# EAGLE schematic cfc-card (EAGLE 9.6.2)

## Sheet 1 of 5: Connectors
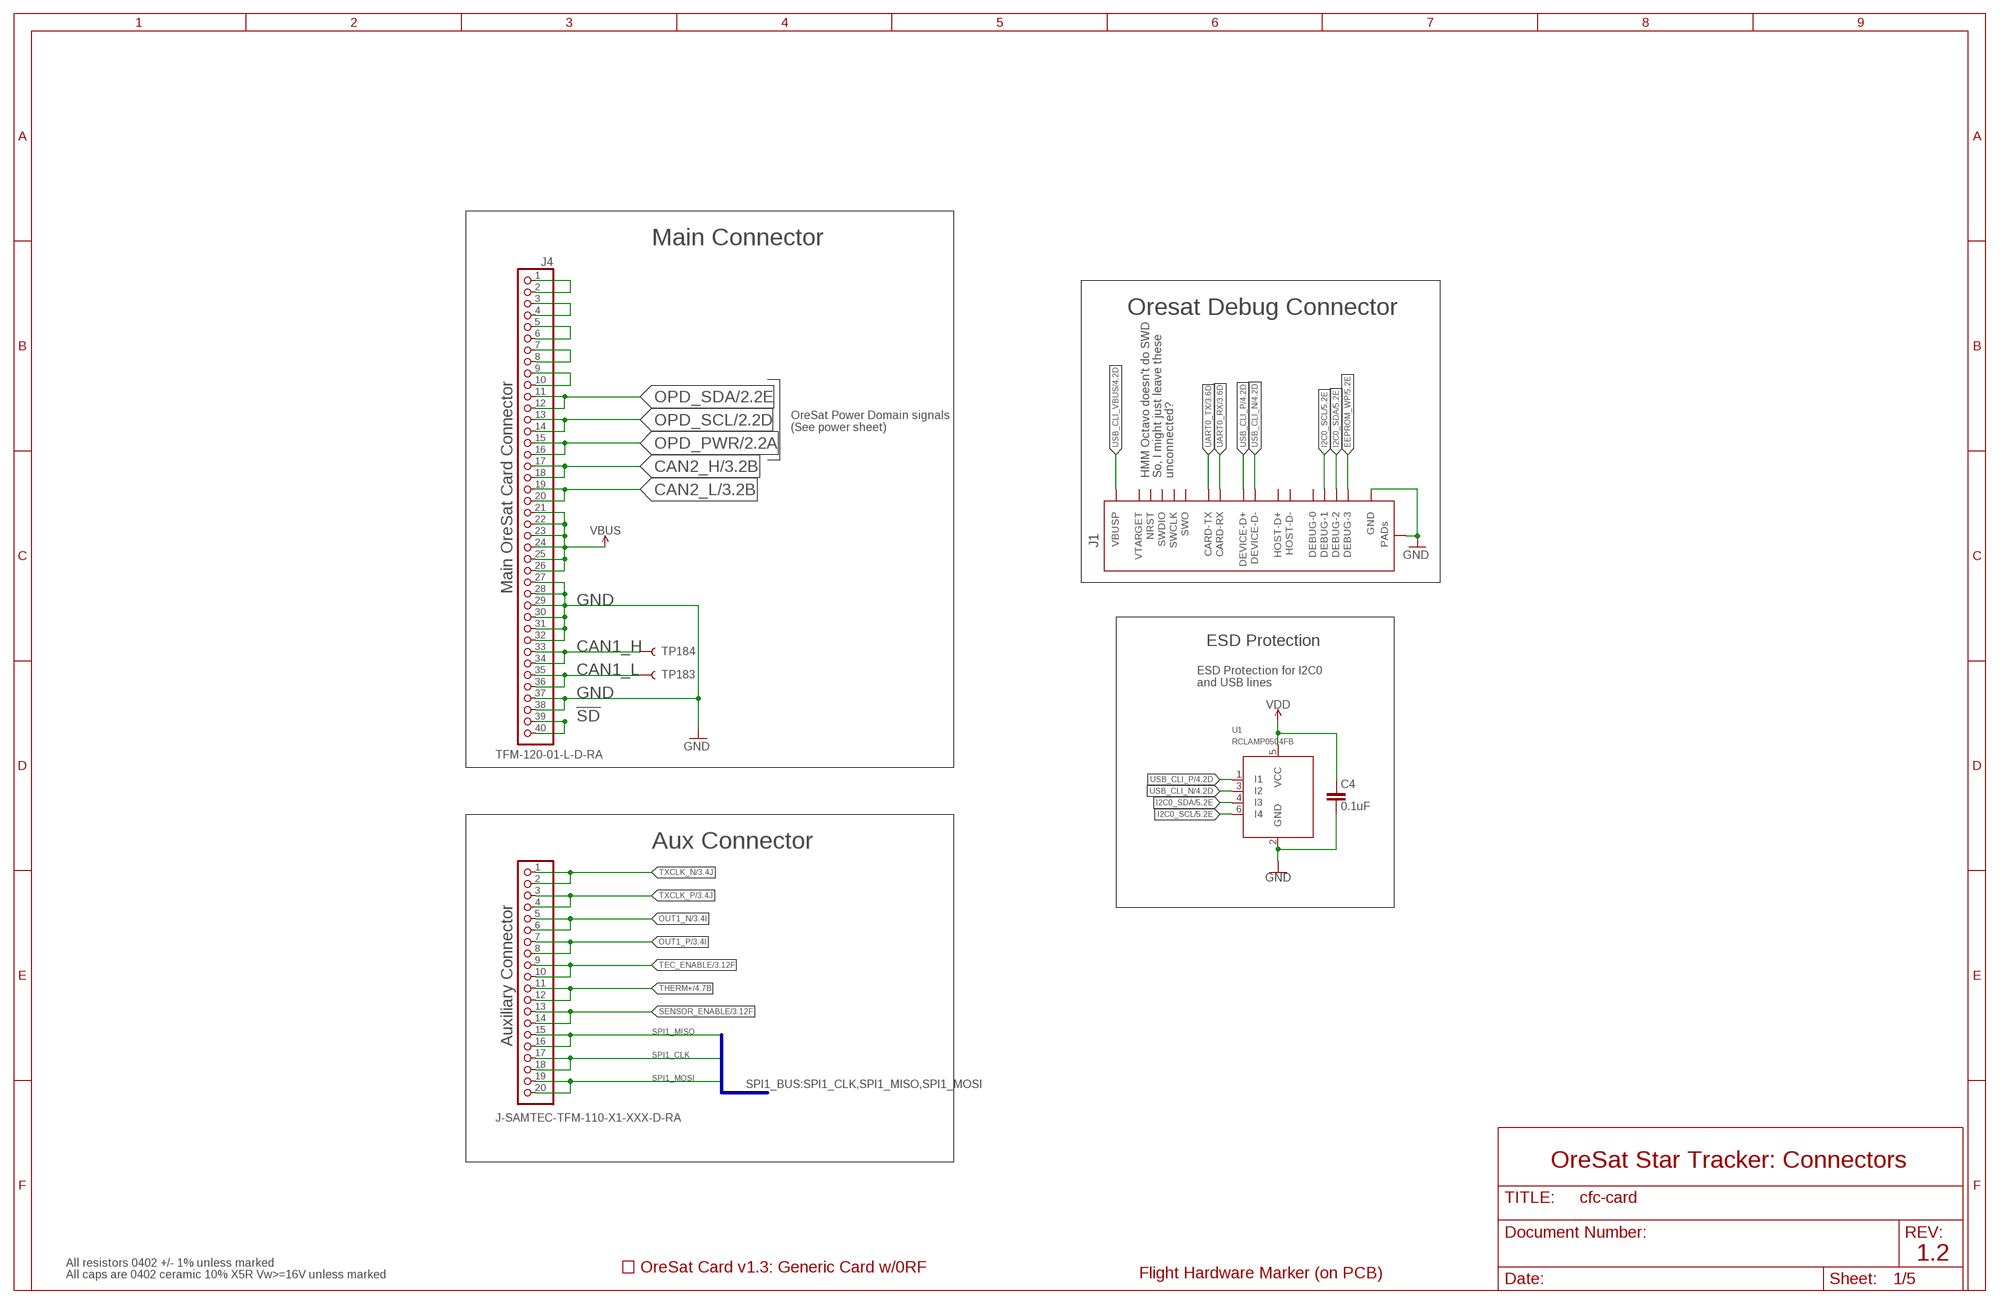
[diagram p0: schematic, sheet 1]

### Parts
C4  0.1uF  C-EU0603-A  [.0603-A]
J1  ORESAT-DEBUG-CONNECTOR-ALL  [TE_2-1734592-0]
J2  J-SAMTEC-TFM-110-X1-XXX-D-RA  [J-SAMTEC-TFM-110-X1-XXX-D-RA]
J4  TFM-120-01-L-D-RA  J-SAMTEC-TFM-120-X1-XXX-D-RA  [J-SAMTEC-TFM-120-X1-XXX-D-RA]
PCB1  ORESAT-CARD-V1.3-GENERIC-0RF  [ORESAT-CARD-V1.3-GENERIC-0RF]
TP183  TEST-POINT3X4  [PAD.03X.04]
TP184  TEST-POINT3X4  [PAD.03X.04]
U1  RCLAMP0504FB  [SC70-6]
U$1  FLIGHMARKERNEW  [FLIGHTMARKER_NEW_BOARDS]

### Nets
!SD: J4.39 J4.40
CAN1_H: J4.33 J4.34 TP184.P$1
CAN1_L: J4.35 J4.36 TP183.P$1
CAN2_H: J4.17 J4.18 ; also sheet 3
CAN2_L: J4.19 J4.20 ; also sheet 3
EEPROM_WP: J1.20(DEBUG-3) ; also sheet 5
GND: C4.2 J1.3(GND) J1.6(GND) J1.9(GND) J1.PAD1(PAD) J1.PAD2(PAD) J4.27 J4.28 J4.29 J4.30 J4.31 J4.32 J4.37 J4.38 U1.2(GND) ; also sheet 2,3,4,5
I2C0_SCL: J1.18(DEBUG-1) U1.6(I4) ; also sheet 5
I2C0_SDA: J1.19(DEBUG-2) U1.4(I3) ; also sheet 5
N$103: J4.1 J4.2
OPD_PWR: J4.15 J4.16 ; also sheet 2
OPD_SCL: J4.13 J4.14 ; also sheet 2
OPD_SDA: J4.11 J4.12 ; also sheet 2
OUT1_N [diff pair]: J2.5 J2.6 ; also sheet 3
OUT1_P [diff pair]: J2.7 J2.8 ; also sheet 3
SENSOR_ENABLE: J2.13 J2.14 ; also sheet 3
SPARE1: J4.9 J4.10
SPARE2: J4.7 J4.8
SPARE3: J4.5 J4.6
SPARE4: J4.3 J4.4
SPI1_CLK: J2.17 J2.18 ; also sheet 3
SPI1_MISO: J2.15 J2.16 ; also sheet 3
SPI1_MOSI: J2.19 J2.20 ; also sheet 3
TEC_ENABLE: J2.9 J2.10 ; also sheet 3
THERM+: J2.11 J2.12 ; also sheet 4
TXCLK_N [diff pair]: J2.1 J2.2 ; also sheet 3
TXCLK_P [diff pair]: J2.3 J2.4 ; also sheet 3
UART0_RX: J1.12(CARD-RX) ; also sheet 3
UART0_TX: J1.13(CARD-TX) ; also sheet 3
USB_CLI_N: J1.5(DEVICE-D-) U1.3(I2) ; also sheet 4
USB_CLI_P: J1.4(DEVICE-D+) U1.1(I1) ; also sheet 4
USB_CLI_VBUS: J1.1(VBUSP) J1.2(VBUSP) ; also sheet 4
VBUS: J4.21 J4.22 J4.23 J4.24 J4.25 J4.26 ; also sheet 2
VDD: C4.1 U1.5(VCC) ; also sheet 5
Unconnected: J1.7(HOST-D+) J1.8(HOST-D-) J1.10(NRST) J1.11(VTARGET) J1.14(SWDIO) J1.15(SWCLK) J1.16(SWO) J1.17(DEBUG-0)

### Buses
SPI1_BUS:SPI1_CLK,SPI1_MISO,SPI1_MOSI

### Notes on the sheet
- Main Connector
- Oresat Debug Connector
- OreSat Power Domain signals
  (See power sheet)
- HMM Octavo doesn't do SWD
  So, I might just leave these 
  unconnected?
- Main OreSat Card Connector
- ESD Protection
- ESD Protection for I2C0 
  and USB lines
- Aux Connector
- Auxiliary Connector
- OreSat Star Tracker: Connectors
- 1.2
- All resistors 0402 +/- 1% unless marked
- All caps are 0402 ceramic 10% X5R Vw>=16V unless marked

## Sheet 2 of 5: Power
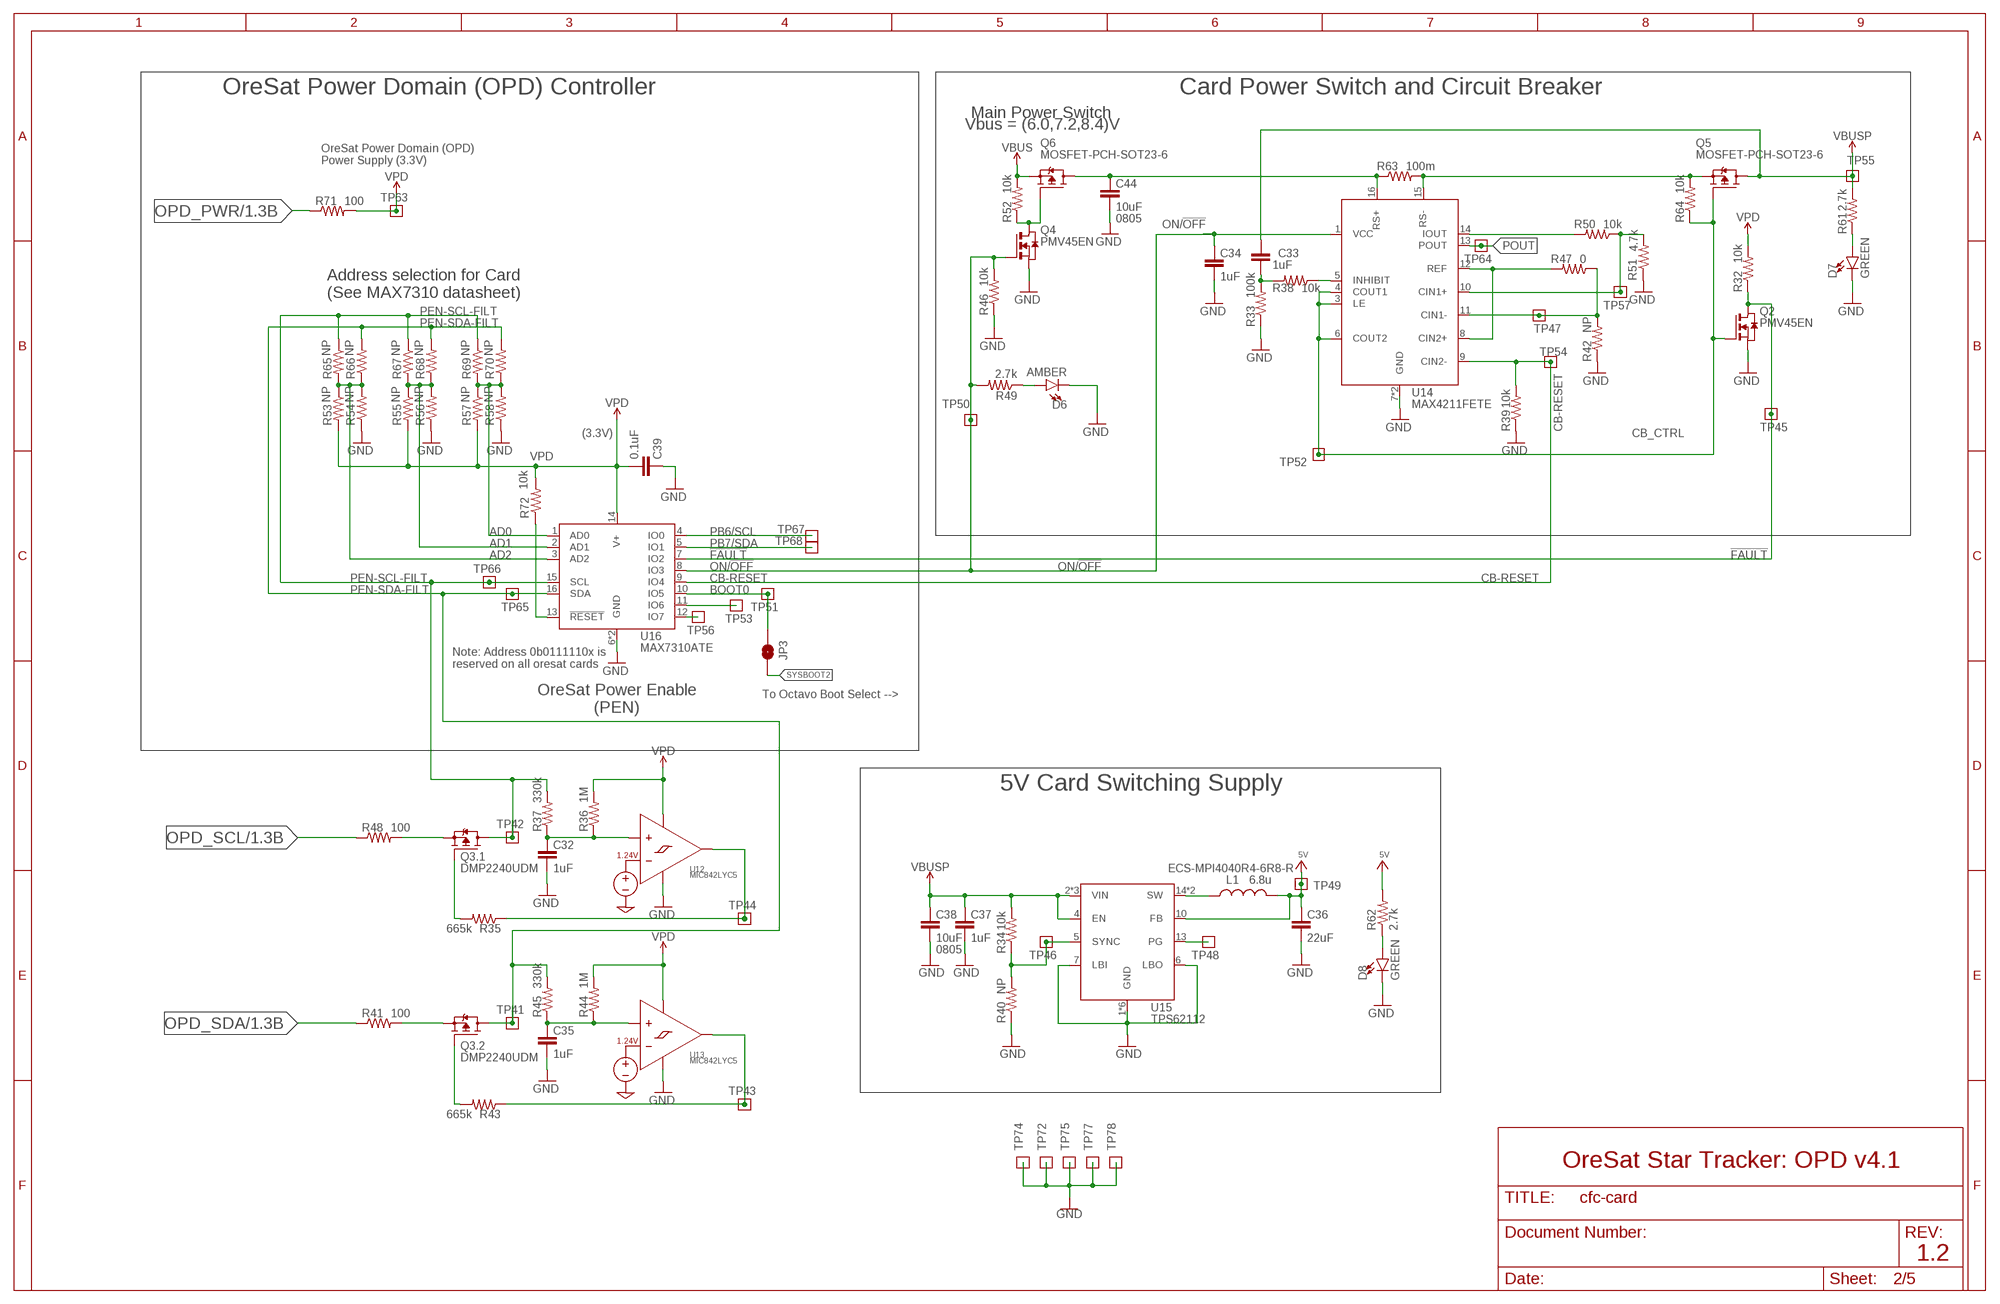
[diagram p1: schematic, sheet 2]

### Parts
C32  1uF  C-EU0805-B-NOSILK  [.0805-B-NOSILK]
C33  1uF  C-EU0603-A  [.0603-A]
C34  1uF  C-EU0603-A  [.0603-A]
C35  1uF  C-EU0805-B-NOSILK  [.0805-B-NOSILK]
C36  22uF  C-EUC1210  [C1210]
C37  1uF  C-EU0603-A  [.0603-A]
C38  10uF  C-EU0805-B  [.0805-B]
C39  0.1uF  C-EU0603-A  [.0603-A]
C44  10uF  C-EU0805-B  [.0805-B]
D6  AMBER  LED-GREEN0603  [LED-0603]
D7  GREEN  LED-GREEN0603  [LED-0603]
D8  GREEN  LED-GREEN0603  [LED-0603]
JP3  JUMPER-SMT_2_NO_SILK  [SMT-JUMPER_2_NO_SILK]
L1  6.8u  L-ECS-MPI4040  [ECS-MPI4040]
Q2  PMV45EN  [SOT23]
Q3  DMP2240UDM  MOSFET-PCH-SOT23-6  [SOT23-6]
Q4  PMV45EN  [SOT23]
Q5  MOSFET-PCH-SOT23-6  [SOT23-6]
Q6  MOSFET-PCH-SOT23-6  [SOT23-6]
R32  10k  R-US_0603-A  [.0603-A]
R33  100k  R-US_0603-A  [.0603-A]
R34  10k  R-US_0603-A  [.0603-A]
R35  665k  R-US_0603-A  [.0603-A]
R36  1M  R-US_0603-A  [.0603-A]
R37  330k  R-US_0603-A  [.0603-A]
R38  10k  R-US_0603-A  [.0603-A]
R39  10k  R-US_0603-A  [.0603-A]
R40  NP  R-US_0603-A  [.0603-A]
R41  100  R-US_0603-A  [.0603-A]
R42  NP  R-US_0603-A  [.0603-A]
R43  665k  R-US_0603-A  [.0603-A]
R44  1M  R-US_0603-A  [.0603-A]
R45  330k  R-US_0603-A  [.0603-A]
R46  10k  R-US_0603-A  [.0603-A]
R47  0  R-US_0603-A  [.0603-A]
R48  100  R-US_0603-A  [.0603-A]
R49  2.7k  R-US_0603-A  [.0603-A]
R50  10k  R-US_0603-A  [.0603-A]
R51  4.7k  R-US_0603-A  [.0603-A]
R52  10k  R-US_0603-A  [.0603-A]
R53  NP  R-US_0603-A  [.0603-A]
R54  NP  R-US_0603-A  [.0603-A]
R55  NP  R-US_0603-A  [.0603-A]
R56  NP  R-US_0603-A  [.0603-A]
R57  NP  R-US_0603-A  [.0603-A]
R58  NP  R-US_0603-A  [.0603-A]
R61  2.7k  R-US_0603-A  [.0603-A]
R62  2.7k  R-US_0603-A  [.0603-A]
R63  100m  R-US_R1206  [R1206]
R64  10k  R-US_0603-A  [.0603-A]
R65  NP  R-US_0603-A  [.0603-A]
R66  NP  R-US_0603-A  [.0603-A]
R67  NP  R-US_0603-A  [.0603-A]
R68  NP  R-US_0603-A  [.0603-A]
R69  NP  R-US_0603-A  [.0603-A]
R70  NP  R-US_0603-A  [.0603-A]
R71  100  R-US_0603-A  [.0603-A]
R72  10k  R-US_0603-A  [.0603-A]
TP41  TEST-POINT  [2MM-TEST-POINT]
TP42  TEST-POINT  [2MM-TEST-POINT]
TP43  TEST-POINT  [2MM-TEST-POINT]
TP44  TEST-POINT  [2MM-TEST-POINT]
TP45  TEST-POINT  [2MM-TEST-POINT]
TP46  TEST-POINT  [2MM-TEST-POINT]
TP47  TEST-POINT  [2MM-TEST-POINT]
TP48  TEST-POINT  [2MM-TEST-POINT]
TP49  TEST-POINT  [2MM-TEST-POINT]
TP50  TEST-POINT  [2MM-TEST-POINT]
TP51  TEST-POINT  [2MM-TEST-POINT]
TP52  TEST-POINT  [2MM-TEST-POINT]
TP53  TEST-POINT  [2MM-TEST-POINT]
TP54  TEST-POINT  [2MM-TEST-POINT]
TP55  TEST-POINT  [2MM-TEST-POINT]
TP56  TEST-POINT  [2MM-TEST-POINT]
TP57  TEST-POINT  [2MM-TEST-POINT]
TP63  TEST-POINT  [2MM-TEST-POINT]
TP64  TEST-POINT  [2MM-TEST-POINT]
TP65  TEST-POINT  [2MM-TEST-POINT]
TP66  TEST-POINT  [2MM-TEST-POINT]
TP67  TEST-POINT  [2MM-TEST-POINT]
TP68  TEST-POINT  [2MM-TEST-POINT]
TP72  TEST-POINT  [2MM-TEST-POINT]
TP74  TEST-POINT  [2MM-TEST-POINT]
TP75  TEST-POINT  [2MM-TEST-POINT]
TP77  TEST-POINT  [2MM-TEST-POINT]
TP78  TEST-POINT  [2MM-TEST-POINT]
U12  MIC842LYC5  [SC70-5]
U13  MIC842LYC5  [SC70-5]
U14  MAX4211FETE  MAX4211  [QFN65P400X400X80-17T210]
U15  TPS62112  TPS6211X  [S-PVQFN-16]
U16  MAX7310ATE  MAX7310  [QFN65P400X400X80-17T210]

### Nets
5V: C36.1 L1.2 R62.2 TP49.1 U15.10(FB) ; also sheet 5
!FAULT: Q2.3(D) R32.1 TP45.1 U16.7(IO2)
AD0: R57.1 R58.2 R69.2 R70.1 U16.1(AD0)
AD1: R55.1 R56.2 R67.2 R68.1 U16.2(AD1)
AD2: R53.1 R54.2 R65.2 R66.1 U16.3(AD2)
BOOT0: JP3.1 TP51.1 U16.10(IO5)
CB-RESET: R39.2 TP54.1 U14.9(CIN2-) U16.9(IO4)
CB_CTRL: Q2.1(G) Q5.3(G) R64.1 TP52.1 U14.3(LE) U14.4(COUT1) U14.6(COUT2)
GND: C32.2 C34.2 C35.2 C36.2 C37.2 C38.2 C39.1 C44.2 D6.C D7.C D8.C Q2.2(S) Q4.2(S) R33.1 R39.1 R40.1 R42.1 R46.1 R51.1 R54.1 R56.1 R58.1 TP72.1 TP74.1 TP75.1 TP77.1 TP78.1 U12.2(GND) U13.2(GND) U14.7(GND) U14.EPAD(GND) U15.1(GND) U15.6(LBO) U15.7(LBI) U15.9(GND) U15.11(GND) U15.12(GND) U15.16(GND) U15.PAD(GND) U16.6(GND) U16.EPAD(GND) ; also sheet 1,3,4,5
IOUT: R50.2 U14.14(IOUT)
N$25: C32.1 R36.1 R37.1 U12.1(INP)
N$27: R35.1 TP44.1 U12.4(OUT)
N$32: TP56.1 U16.12(IO7)
N$98: C44.1 Q6.1(D) Q6.2(D) Q6.5(D) Q6.6(D) R63.1 U14.16(RS+)
N$99: Q5.4(S) R63.2 R64.2 U14.15(RS-)
N$100: C35.1 R44.1 R45.1 U13.1(INP)
N$113: Q3.3(.2:G) R43.2
N$117: Q3.1(.1:G) R35.2
N$270: D7.A R61.1
N$271: D8.A R62.1
N$385: TP53.1 U16.11(IO6)
N$479: Q3.5(.1:S) R48.2
N$575: D6.A R49.1
N$579: Q3.2(.2:S) R41.2
N$580: R43.1 TP43.1 U13.4(OUT)
N$589: R72.1 U16.13(!RESET)
N$590: Q4.3(D) Q6.3(G) R52.1
N$596: R50.1 R51.2 TP57.1 U14.10(CIN1+)
N$597: R42.2 R47.1 TP47.1 U14.11(CIN1-)
N$599: R47.2 U14.8(CIN2+) U14.12(REF)
N$603: C33.1 R33.2 R38.2
N$604: R38.1 U14.5(INHIBIT)
ON/!OFF: C34.1 Q4.1(G) R46.2 R49.2 TP50.1 U14.1(VCC) U16.8(IO3)
OPD_PWR: R71.1 ; also sheet 1
OPD_SCL: R48.1 ; also sheet 1
OPD_SDA: R41.1 ; also sheet 1
PB6/SCL: TP67.1 U16.4(IO0)
PB7/SDA: TP68.1 U16.5(IO1)
PEN-SCL-FILT: Q3.6(.1:D) R37.2 R65.1 R67.1 R69.1 TP42.1 TP66.1 U16.15(SCL)
PEN-SDA-FILT: Q3.4(.2:D) R45.2 R66.2 R68.2 R70.2 TP41.1 TP65.1 U16.16(SDA)
POUT: TP64.1 U14.13(POUT)
SYSBOOT2: JP3.2 ; also sheet 3
TPS62111-PG: TP48.1 U15.13(PG)
TPS62111-SYNC: R34.1 R40.2 TP46.1 U15.5(SYNC)
TPS62111_SW: L1.1 U15.14(SW) U15.15(SW)
VBUS: Q6.4(S) R52.2 ; also sheet 1
VBUSP: C33.2 C37.1 C38.1 Q5.1(D) Q5.2(D) Q5.5(D) Q5.6(D) R34.2 R61.2 TP55.1 U15.2(VIN) U15.3(VIN) U15.4(EN) U15.8(VIN)
VPD: C39.2 R32.2 R36.2 R44.2 R53.2 R55.2 R57.2 R71.2 R72.2 TP63.1 U12.5(VDD) U13.5(VDD) U16.14(V+)

### Notes on the sheet
- OreSat Power Domain (OPD) Controller | Card Power Switch and Circuit Breaker
- Main Power Switch
- Vbus = (6.0,7.2,8.4)V
- OreSat Power Domain (OPD)
  Power Supply (3.3V)
- 0805
- Address selection for Card
  (See MAX7310 datasheet)
- (3.3V)
- Note: Address 0b0111110x is 
  reserved on all oresat cards
- OreSat Power Enable
  (PEN)
- To Octavo Boot Select -->
- 5V Card Switching Supply
- ECS-MPI4040R4-6R8-R
- 0805
- OreSat Star Tracker: OPD v4.1
- 1.2

## Sheet 3 of 5: OSD3358 SD, eMMC, etc : SIP C, D
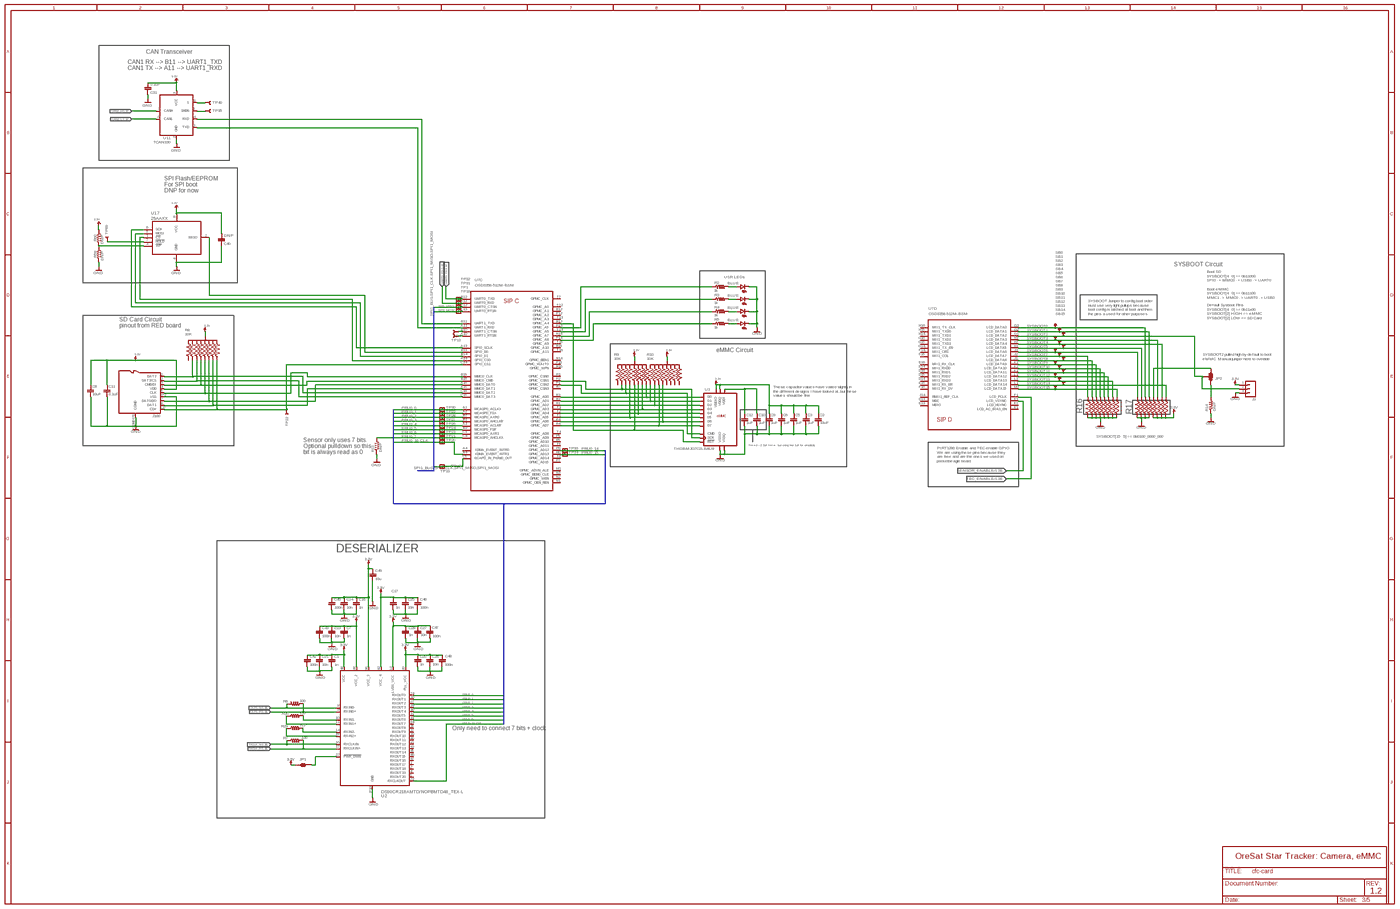
[diagram p2: schematic, sheet 3, overview]
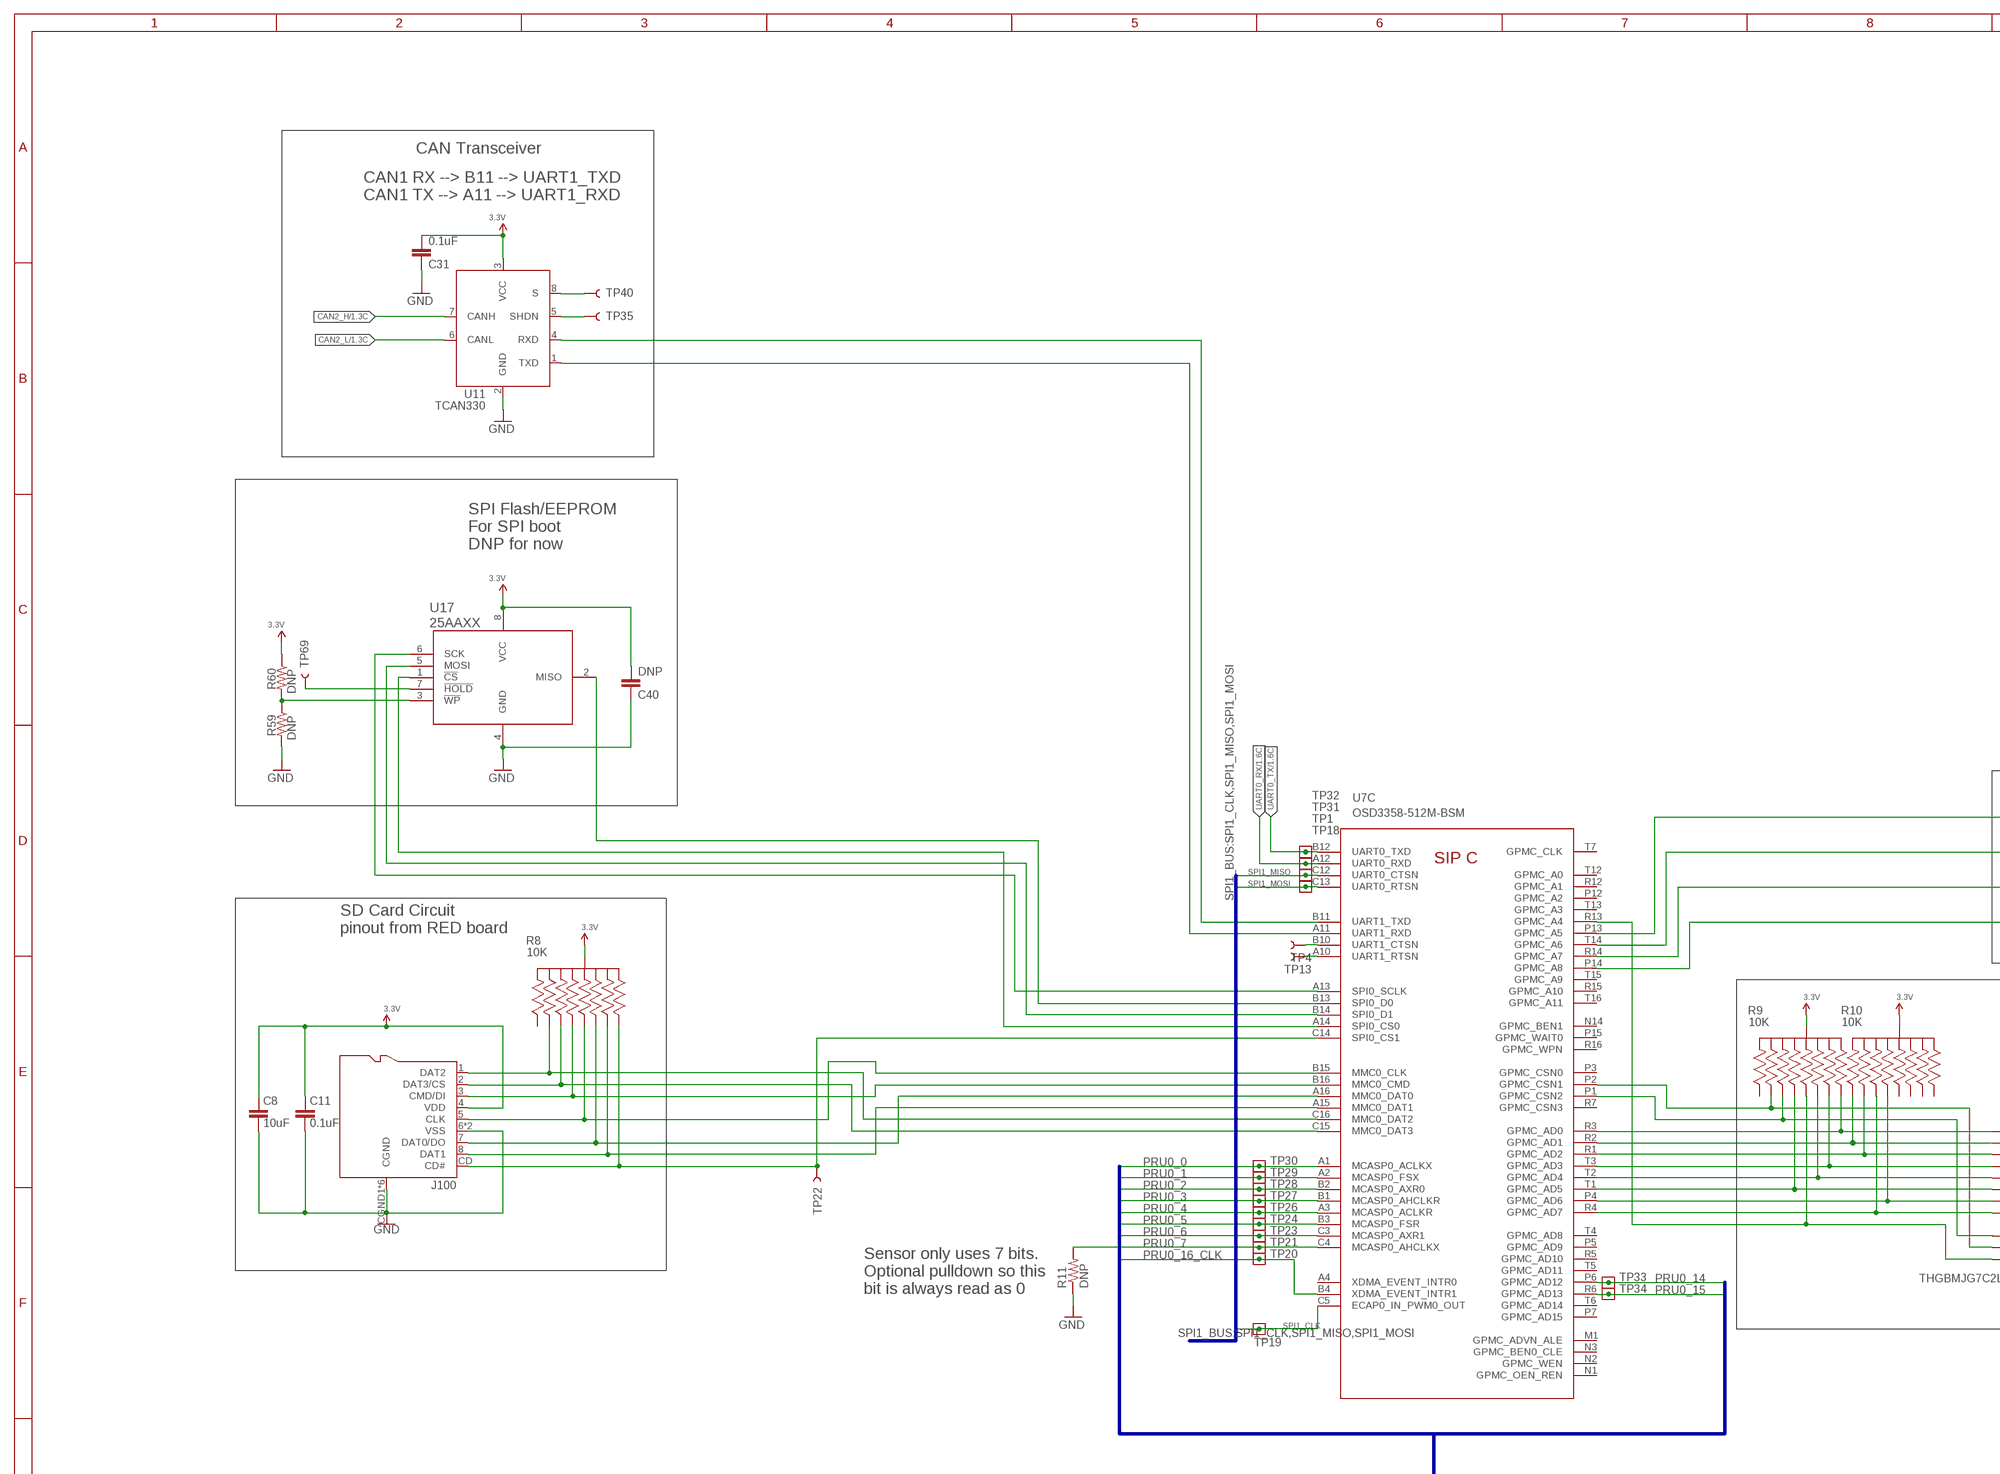
[diagram p3: schematic, sheet 3, part 1 of 4]
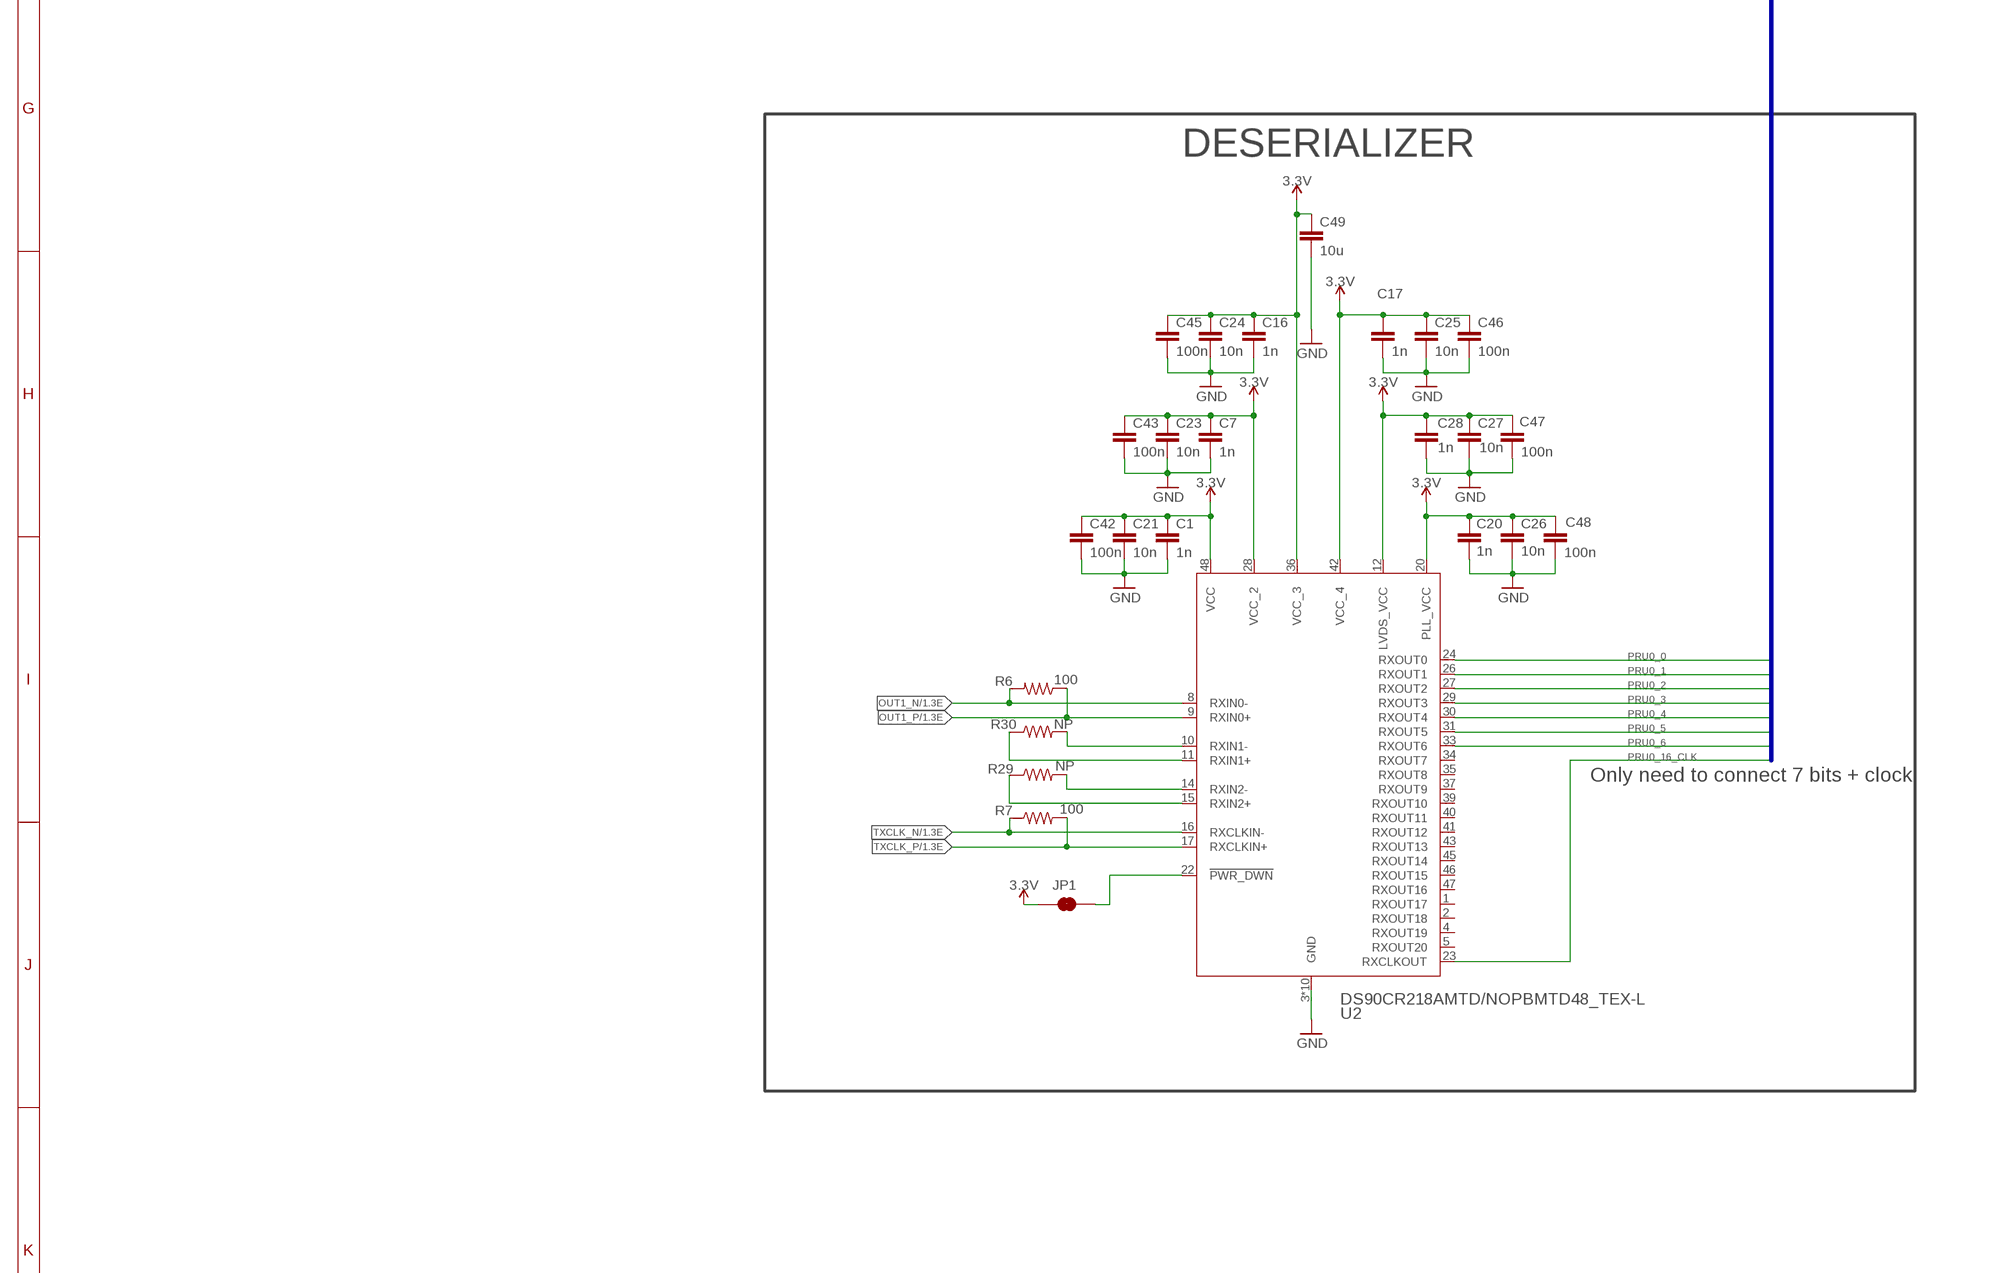
[diagram p4: schematic, sheet 3, part 2 of 4]
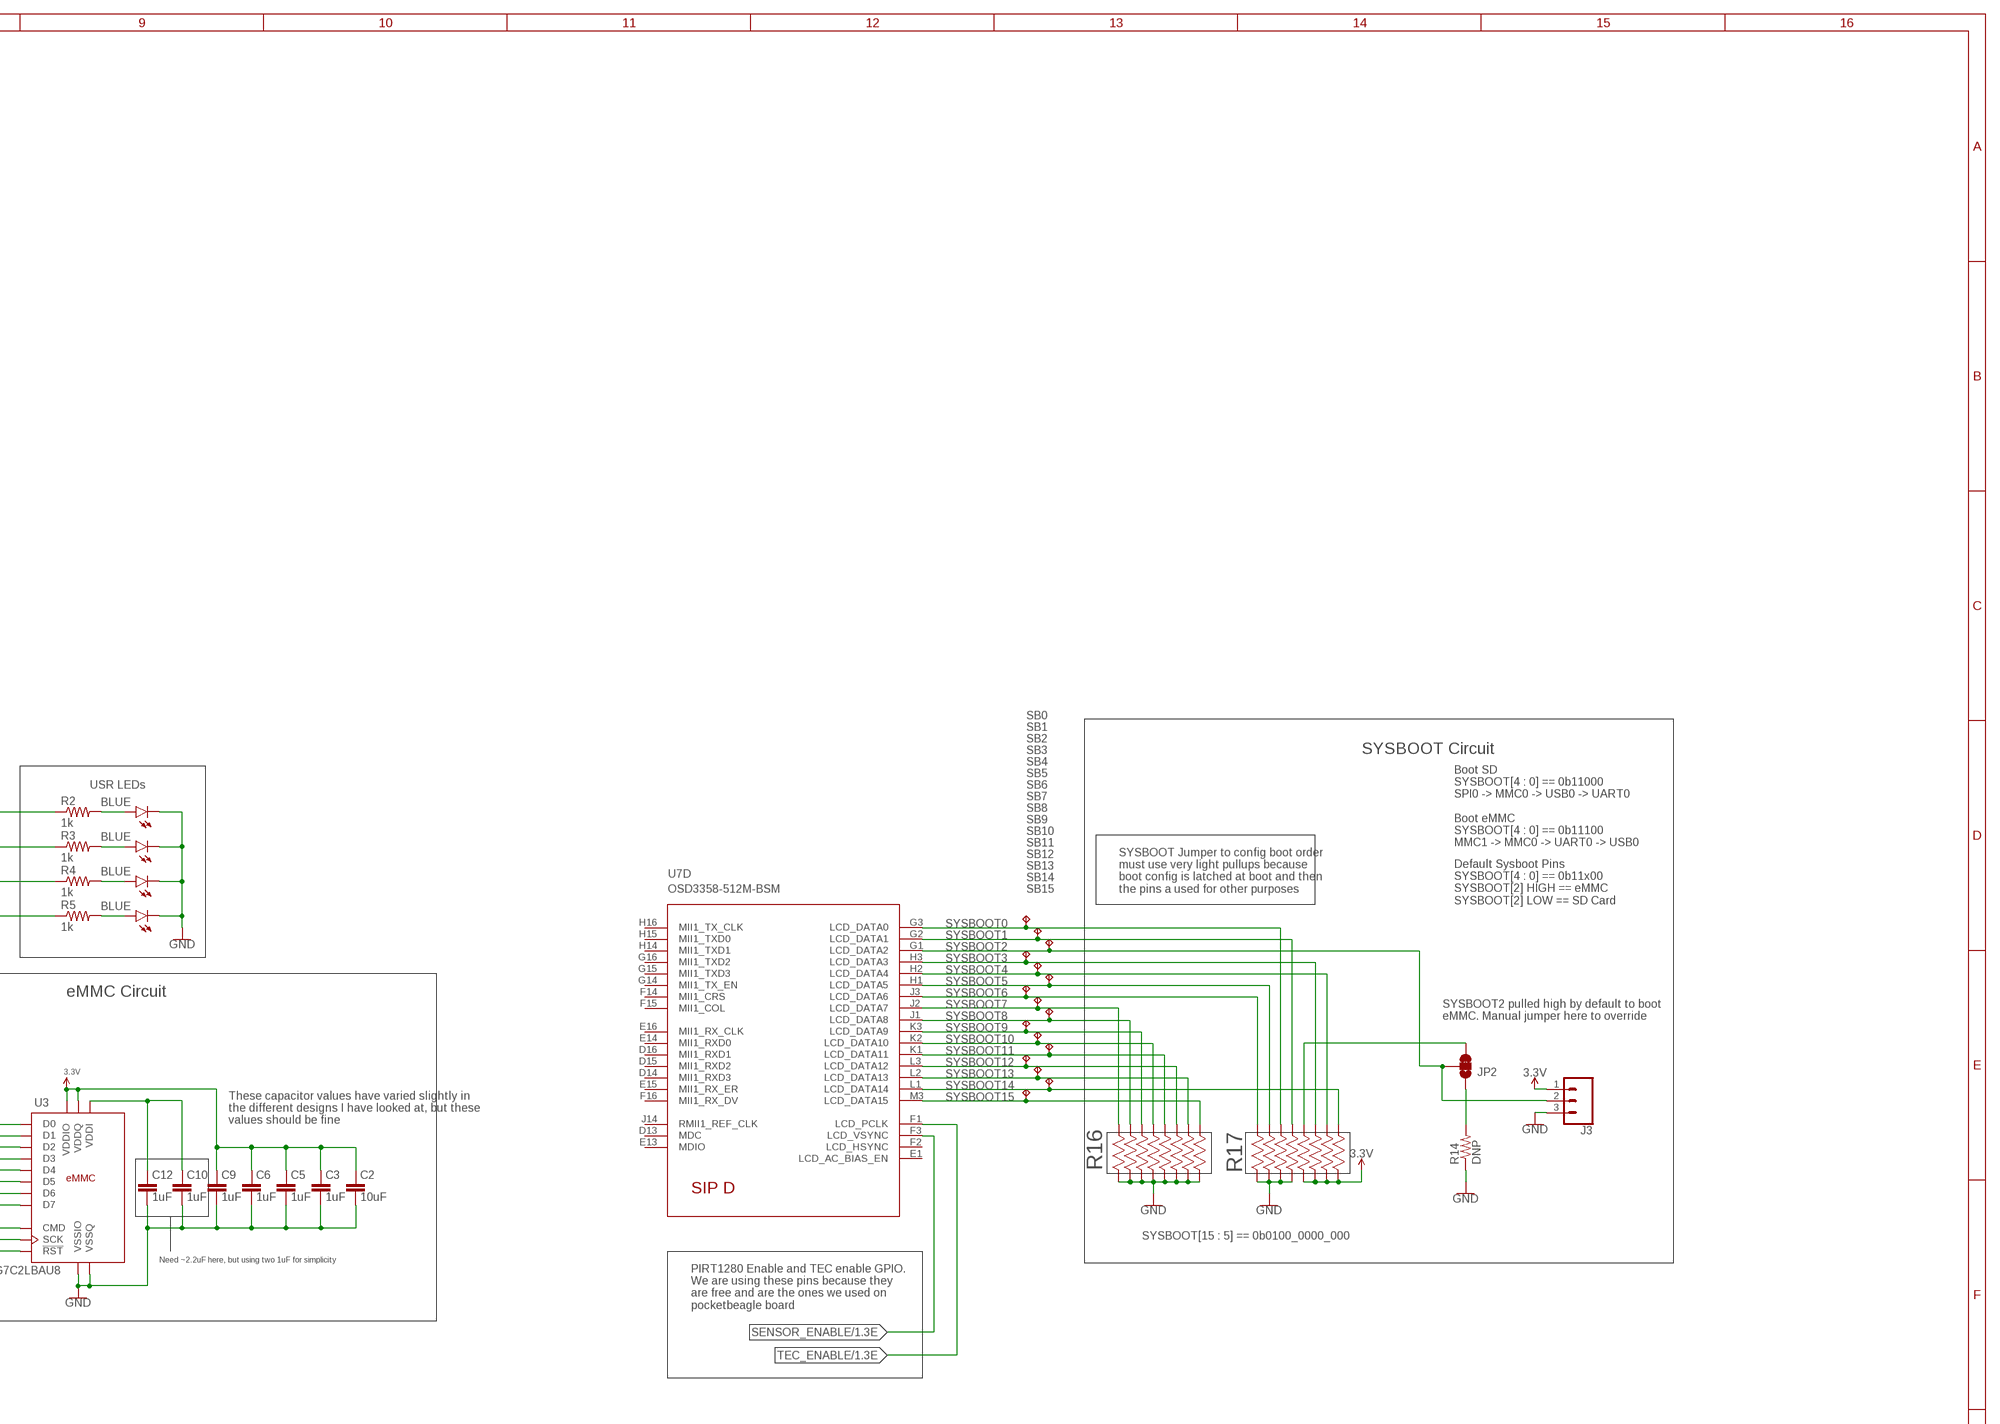
[diagram p5: schematic, sheet 3, part 3 of 4]
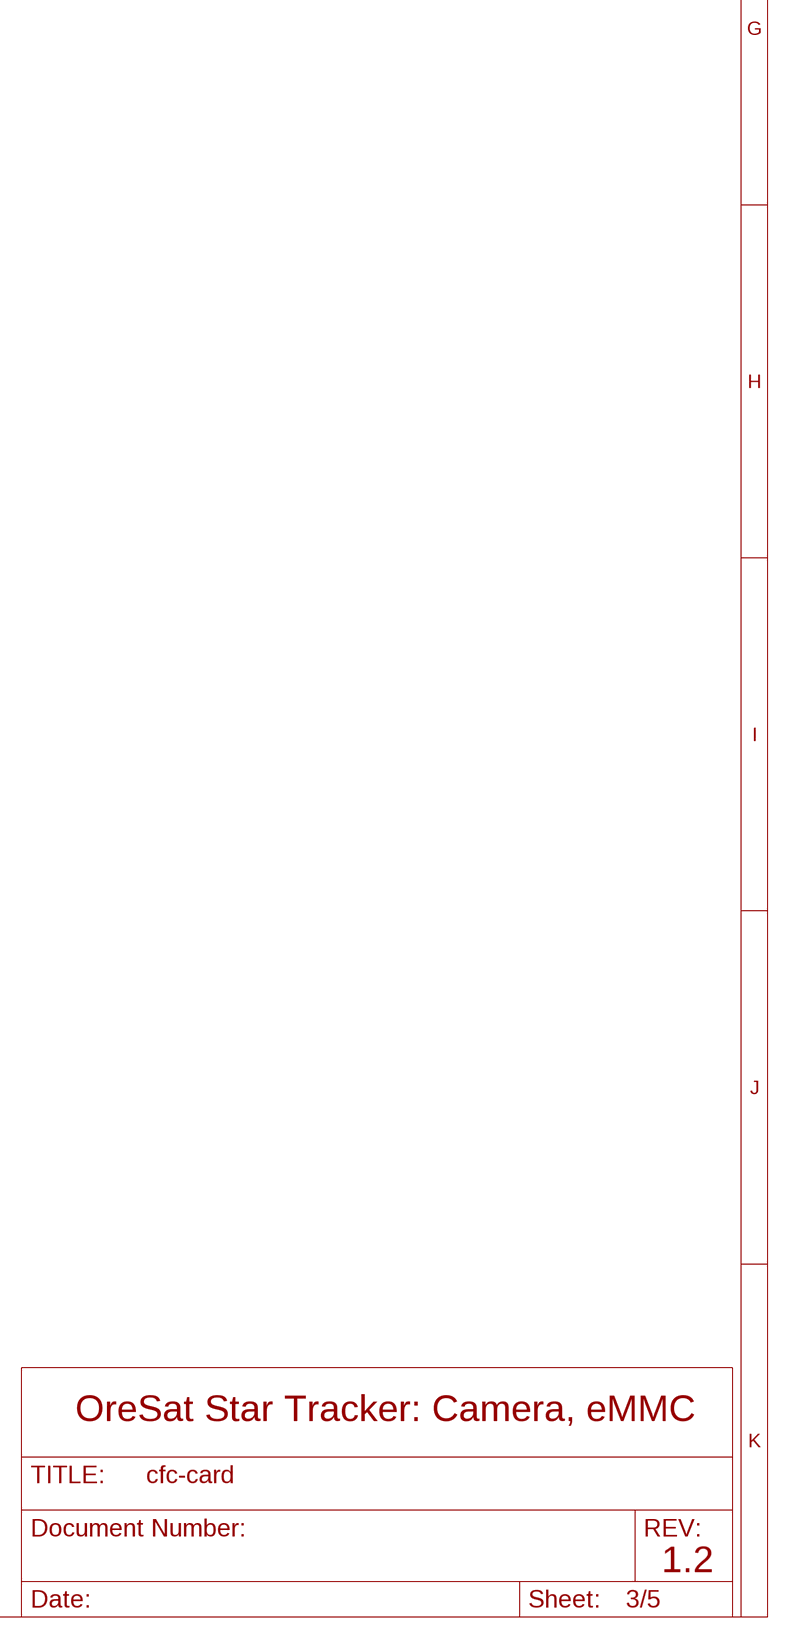
[diagram p6: schematic, sheet 3, part 4 of 4]

### Parts
C1  1n  C-EU0402-C-NOSILK  [.0402-C-NOSILK]
C2  10uF  C-EU0805-B  [.0805-B]
C3  1uF  C-EU0603-A  [.0603-A]
C5  1uF  C-EU0603-A  [.0603-A]
C6  1uF  C-EU0603-A  [.0603-A]
C7  1n  C-EU0402-C-NOSILK  [.0402-C-NOSILK]
C8  10uF  C-EU0805-B  [.0805-B]
C9  1uF  C-EU0603-A  [.0603-A]
C10  1uF  C-EU0603-A  [.0603-A]
C11  0.1uF  C-EU0603-A  [.0603-A]
C12  1uF  C-EU0603-A  [.0603-A]
C16  1n  C-EU0402-C-NOSILK  [.0402-C-NOSILK]
C17  1n  C-EU0402-C-NOSILK  [.0402-C-NOSILK]
C20  1n  C-EU0402-C-NOSILK  [.0402-C-NOSILK]
C21  10n  C-EU0402-C-NOSILK  [.0402-C-NOSILK]
C23  10n  C-EU0402-C-NOSILK  [.0402-C-NOSILK]
C24  10n  C-EU0402-C-NOSILK  [.0402-C-NOSILK]
C25  10n  C-EU0402-C-NOSILK  [.0402-C-NOSILK]
C26  10n  C-EU0402-C-NOSILK  [.0402-C-NOSILK]
C27  10n  C-EU0402-C-NOSILK  [.0402-C-NOSILK]
C28  1n  C-EU0402-C-NOSILK  [.0402-C-NOSILK]
C31  0.1uF  C-EU0603-A  [.0603-A]
C40  DNP  C-EU0603-A  [.0603-A]
C42  100n  C-EU0402-C-NOSILK  [.0402-C-NOSILK]
C43  100n  C-EU0402-C-NOSILK  [.0402-C-NOSILK]
C45  100n  C-EU0402-C-NOSILK  [.0402-C-NOSILK]
C46  100n  C-EU0402-C-NOSILK  [.0402-C-NOSILK]
C47  100n  C-EU0402-C-NOSILK  [.0402-C-NOSILK]
C48  100n  C-EU0402-C-NOSILK  [.0402-C-NOSILK]
C49  10u  C-EU0603-C-NOSILK  [.0603-C-NOSILK]
D2  BLUE  LED-BLUE0603  [LED-0603]
D3  BLUE  LED-BLUE0603  [LED-0603]
D4  BLUE  LED-BLUE0603  [LED-0603]
D5  BLUE  LED-BLUE0603  [LED-0603]
J3  CONN_03LONGPADS  [1X03_LONGPADS]
J100  DM3BT-DSF-PEJS  [DM3BT-DSF-PEJS]
JP1  JUMPER-SMT_2_NC_TRACE_SILK  [SMT-JUMPER_2_NC_TRACE_SILK]
JP2  JUMPER-SMT_3_1-NC_TRACE_SILK  [SMT-JUMPER_3_1-NC_TRACE_SILK]
R2  1k  R-US_0603-A  [.0603-A]
R3  1k  R-US_0603-A  [.0603-A]
R4  1k  R-US_0603-A  [.0603-A]
R5  1k  R-US_0603-A  [.0603-A]
R6  100  R-US_0402-C-NOSILK  [.0402-C-NOSILK]
R7  100  R-US_0402-C-NOSILK  [.0402-C-NOSILK]
R8  10K  EXB-A10P391JC_ARRAY_EXBA-M  [ARRAY_EXBA-M]
R9  10K  EXB-A10P391JC_ARRAY_EXBA-M  [ARRAY_EXBA-M]
R10  10K  EXB-A10P391JC_ARRAY_EXBA-M  [ARRAY_EXBA-M]
R11  DNP  R-US_0603-A  [.0603-A]
R14  DNP  R-US_0603-A  [.0603-A]
R16  100k  EXB-2HV103JV  [RES_EXB2HV]
R17  100k  EXB-2HV103JV  [RES_EXB2HV]
R29  NP  R-US_0402-C-NOSILK  [.0402-C-NOSILK]
R30  NP  R-US_0402-C-NOSILK  [.0402-C-NOSILK]
R59  DNP  R-US_0603-A  [.0603-A]
R60  DNP  R-US_0603-A  [.0603-A]
SB0  TEST-POINT-SMALL  [TEST-POINT-SMALL]
SB1  TEST-POINT-SMALL  [TEST-POINT-SMALL]
SB2  TEST-POINT-SMALL  [TEST-POINT-SMALL]
SB3  TEST-POINT-SMALL  [TEST-POINT-SMALL]
SB4  TEST-POINT-SMALL  [TEST-POINT-SMALL]
SB5  TEST-POINT-SMALL  [TEST-POINT-SMALL]
SB6  TEST-POINT-SMALL  [TEST-POINT-SMALL]
SB7  TEST-POINT-SMALL  [TEST-POINT-SMALL]
SB8  TEST-POINT-SMALL  [TEST-POINT-SMALL]
SB9  TEST-POINT-SMALL  [TEST-POINT-SMALL]
SB10  TEST-POINT-SMALL  [TEST-POINT-SMALL]
SB11  TEST-POINT-SMALL  [TEST-POINT-SMALL]
SB12  TEST-POINT-SMALL  [TEST-POINT-SMALL]
SB13  TEST-POINT-SMALL  [TEST-POINT-SMALL]
SB14  TEST-POINT-SMALL  [TEST-POINT-SMALL]
SB15  TEST-POINT-SMALL  [TEST-POINT-SMALL]
TP1  TEST-POINT  [2MM-TEST-POINT]
TP4  TEST-POINT3X4  [PAD.03X.04]
TP13  TEST-POINT3X4  [PAD.03X.04]
TP18  TEST-POINT  [2MM-TEST-POINT]
TP19  TEST-POINT  [2MM-TEST-POINT]
TP20  TEST-POINT  [2MM-TEST-POINT]
TP21  TEST-POINT  [2MM-TEST-POINT]
TP22  TEST-POINT3X4  [PAD.03X.04]
TP23  TEST-POINT  [2MM-TEST-POINT]
TP24  TEST-POINT  [2MM-TEST-POINT]
TP26  TEST-POINT  [2MM-TEST-POINT]
TP27  TEST-POINT  [2MM-TEST-POINT]
TP28  TEST-POINT  [2MM-TEST-POINT]
TP29  TEST-POINT  [2MM-TEST-POINT]
TP30  TEST-POINT  [2MM-TEST-POINT]
TP31  TEST-POINT  [2MM-TEST-POINT]
TP32  TEST-POINT  [2MM-TEST-POINT]
TP33  TEST-POINT  [2MM-TEST-POINT]
TP34  TEST-POINT  [2MM-TEST-POINT]
TP35  TEST-POINT3X4  [PAD.03X.04]
TP40  TEST-POINT3X4  [PAD.03X.04]
TP69  TEST-POINT3X4  [PAD.03X.04]
U2  DS90CR218AMTD/NOPBMTD48_TEX-L  [MTD48_TEX-L]
U3  THGBMJG7C2LBAU8  EMMC+RESET+5.1-COMPATIBLE-BA  [BGA-153(11.5X13)(EMMC-BA)]
U7  OSD3358-512M-BSM  [OSD335X-BGA-256]
U11  TCAN330  [SOT23-8_TI-DCN]
U17  25AAXX  [SOIC8]

### Nets
3.3V: C1.1 C2.1 C3.1 C5.1 C6.1 C7.1 C8.1 C9.1 C11.1 C16.1 C17.1 C20.1 C21.1 C23.1 C24.1 C25.1 C26.1 C27.1 C28.1 C31.2 C40.2 C42.1 C43.1 C45.1 C46.1 C47.1 C48.1 C49.1 J3.1 J100.4(VDD) JP1.1 R8.5 R8.10 R9.5 R9.10 R10.5 R10.10 R17.5 R17.6 R17.7 R17.8 R60.1 U2.12(LVDS_VCC) U2.20(PLL_VCC) U2.28(VCC_2) U2.36(VCC_3) U2.42(VCC_4) U2.48(VCC) U3.C6(VDDQ) U3.E6(VDDIO) U3.F5(VDDIO) U3.J10(VDDIO) U3.K9(VDDIO) U3.M4(VDDQ) U3.N4(VDDQ) U3.P3(VDDQ) U3.P5(VDDQ) U11.3(VCC) U17.8(VCC) ; also sheet 5
!EMMC_RST: R9.3 U3.K5(!RST!) U7.R13(C:GPMC_A4)
!PWR_DWN: JP1.2 U2.22(!PWR_DWN)
CAN2_H: U11.7(CANH) ; also sheet 1
CAN2_L: U11.6(CANL) ; also sheet 1
EMMC_CLK: R9.9 U3.M6(SCK) U7.P2(C:GPMC_CSN1)
EMMC_CMD: R9.2 U3.M5(CMD) U7.P1(C:GPMC_CSN2)
EMMC_DAT0: R9.6 U3.A3(D0) U7.R3(C:GPMC_AD0)
EMMC_DAT1: R10.1 U3.A4(D1) U7.R2(C:GPMC_AD1)
EMMC_DAT2: R10.9 U3.A5(D2) U7.R1(C:GPMC_AD2)
EMMC_DAT3: R9.4 U3.B2(D3) U7.T3(C:GPMC_AD3)
EMMC_DAT4: R9.7 U3.B3(D4) U7.T2(C:GPMC_AD4)
EMMC_DAT5: R9.8 U3.B4(D5) U7.T1(C:GPMC_AD5)
EMMC_DAT6: R10.8 U3.B5(D6) U7.P4(C:GPMC_AD6)
EMMC_DAT7: R10.2 U3.B6(D7) U7.R4(C:GPMC_AD7)
GND: C1.2 C2.2 C3.2 C5.2 C6.2 C7.2 C8.2 C9.2 C10.2 C11.2 C12.2 C16.2 C17.2 C20.2 C21.2 C23.2 C24.2 C25.2 C26.2 C27.2 C28.2 C31.1 C40.1 C42.2 C43.2 C45.2 C46.2 C47.2 C48.2 C49.2 D2.C D3.C D4.C D5.C J3.3 J100.6(VSS) J100.CGND1(CGND) J100.CGND2(CGND) J100.CGND3(CGND) J100.CGND4(CGND) J100.CGND5(CGND) J100.CGND6(CGND) J100.GND(VSS) R11.1 R14.1 R16.1 R16.2 R16.3 R16.4 R16.5 R16.6 R16.7 R16.8 R17.1 R17.2 R17.3 R17.4 R59.2 U2.3(GND) U2.7(GND) U2.13(GND) U2.18(GND) U2.19(GND) U2.21(GND) U2.25(GND) U2.32(GND) U2.38(GND) U2.44(GND) U3.A6(VSSIO) U3.C4(VSSQ) U3.E7(VSSIO) U3.G5(VSSIO) U3.H10(VSSIO) U3.J5(VSSIO) U3.K8(VSSIO) U3.N2(VSSQ) U3.N5(VSSQ) U3.P4(VSSQ) U3.P6(VSSQ) U11.2(GND) U17.4(GND) ; also sheet 1,2,4,5
N$1: JP2.1 R14.2
N$2: D5.A R5.2
N$3: R29.2 U2.14(RXIN2-)
N$4: J100.1(DAT2) R8.9 U7.C16(C:MMC0_DAT2)
N$5: J100.2(DAT3/CS) R8.2 U7.C15(C:MMC0_DAT3)
N$6: J100.3(CMD/DI) R8.8 U7.B16(C:MMC0_CMD)
N$7: J100.5(CLK) R8.3 U7.B15(C:MMC0_CLK)
N$9: J100.8(DAT1) R8.4 U7.A15(C:MMC0_DAT1)
N$10: J100.CD(CD#) R8.6 TP22.P$1 U7.C14(C:SPI0_CS1)
N$11: U7.B11(C:UART1_TXD) U11.4(RXD)
N$12: U7.A11(C:UART1_RXD) U11.1(TXD)
N$13: TP40.P$1 U11.8(S)
N$14: TP35.P$1 U11.5(SHDN)
N$15: J100.7(DAT0/DO) R8.7 U7.A16(C:MMC0_DAT0)
N$19: JP2.3 R17.12
N$20: TP4.P$1 U7.B10(C:UART1_CTSN)
N$28: U7.A13(C:SPI0_SCLK) U17.6(SCK)
N$29: U7.B13(C:SPI0_D0) U17.2(MISO)
N$30: U7.B14(C:SPI0_D1) U17.5(MOSI)
N$31: U7.A14(C:SPI0_CS0) U17.1(!CS)
N$33: R29.1 U2.15(RXIN2+)
N$34: R30.2 U2.10(RXIN1-)
N$35: R30.1 U2.11(RXIN1+)
N$80: D4.A R4.2
N$81: D3.A R3.2
N$87: D2.A R2.2
N$110: R59.1 R60.2 U17.3(!WP)
N$111: TP69.P$1 U17.7(!HOLD)
N$112: TP13.P$1 U7.A10(C:UART1_RTSN)
N$640: C10.1 C12.1 U3.C2(VDDI)
N$653: R2.1 U7.P13(C:GPMC_A5)
N$654: R3.1 U7.T14(C:GPMC_A6)
N$655: R4.1 U7.R14(C:GPMC_A7)
N$656: R5.1 U7.P14(C:GPMC_A8)
OUT1_N [diff pair]: R6.2 U2.8(RXIN0-) ; also sheet 1
OUT1_P [diff pair]: R6.1 U2.9(RXIN0+) ; also sheet 1
PRU0_0: TP30.1 U2.24(RXOUT0) U7.A1(C:MCASP0_ACLKX)
PRU0_1: TP29.1 U2.26(RXOUT1) U7.A2(C:MCASP0_FSX)
PRU0_2: TP28.1 U2.27(RXOUT2) U7.B2(C:MCASP0_AXR0)
PRU0_3: TP27.1 U2.29(RXOUT3) U7.B1(C:MCASP0_AHCLKR)
PRU0_4: TP26.1 U2.30(RXOUT4) U7.A3(C:MCASP0_ACLKR)
PRU0_5: TP24.1 U2.31(RXOUT5) U7.B3(C:MCASP0_FSR)
PRU0_6: TP23.1 U2.33(RXOUT6) U7.C3(C:MCASP0_AXR1)
PRU0_7: R11.2 TP21.1 U7.C4(C:MCASP0_AHCLKX)
PRU0_14: TP33.1 U7.P6(C:GPMC_AD12)
PRU0_15: TP34.1 U7.R6(C:GPMC_AD13)
PRU0_16_CLK: TP20.1 U2.23(RXCLKOUT) U7.B4(C:XDMA_EVENT_INTR1)
SENSOR_ENABLE: U7.F3(D:LCD_VSYNC) ; also sheet 1
SPI1_CLK: TP19.1 U7.C5(C:ECAP0_IN_PWM0_OUT) ; also sheet 1
SPI1_MISO: TP1.1 U7.C12(C:UART0_CTSN) ; also sheet 1
SPI1_MOSI: TP18.1 U7.C13(C:UART0_RTSN) ; also sheet 1
SYSBOOT0: R17.14 SB0.TP U7.G3(D:LCD_DATA0)
SYSBOOT1: R17.13 SB1.TP U7.G2(D:LCD_DATA1)
SYSBOOT2: J3.2 JP2.2 SB2.TP U7.G1(D:LCD_DATA2) ; also sheet 2
SYSBOOT3: R17.11 SB3.TP U7.H3(D:LCD_DATA3)
SYSBOOT4: R17.10 SB4.TP U7.H2(D:LCD_DATA4)
SYSBOOT5: R17.15 SB5.TP U7.H1(D:LCD_DATA5)
SYSBOOT6: R17.16 SB6.TP U7.J3(D:LCD_DATA6)
SYSBOOT7: R16.16 SB7.TP U7.J2(D:LCD_DATA7)
SYSBOOT8: R16.15 SB8.TP U7.J1(D:LCD_DATA8)
SYSBOOT9: R16.14 SB9.TP U7.K3(D:LCD_DATA9)
SYSBOOT10: R16.13 SB10.TP U7.K2(D:LCD_DATA10)
SYSBOOT11: R16.12 SB11.TP U7.K1(D:LCD_DATA11)
SYSBOOT12: R16.11 SB12.TP U7.L3(D:LCD_DATA12)
SYSBOOT13: R16.10 SB13.TP U7.L2(D:LCD_DATA13)
SYSBOOT14: R17.9 SB14.TP U7.L1(D:LCD_DATA14)
SYSBOOT15: R16.9 SB15.TP U7.M3(D:LCD_DATA15)
TEC_ENABLE: U7.F1(D:LCD_PCLK) ; also sheet 1
TXCLK_N [diff pair]: R7.1 U2.16(RXCLKIN-) ; also sheet 1
TXCLK_P [diff pair]: R7.2 U2.17(RXCLKIN+) ; also sheet 1
UART0_RX: TP31.1 U7.A12(C:UART0_RXD) ; also sheet 1
UART0_TX: TP32.1 U7.B12(C:UART0_TXD) ; also sheet 1
Unconnected: R8.1 R9.1 R10.3 R10.4 R10.6 R10.7 U2.1(RXOUT17) U2.2(RXOUT18) U2.4(RXOUT19) U2.5(RXOUT20) U2.34(RXOUT7) U2.35(RXOUT8) U2.37(RXOUT9) U2.39(RXOUT10) U2.40(RXOUT11) U2.41(RXOUT12) U2.43(RXOUT13) U2.45(RXOUT14) U2.46(RXOUT15) U2.47(RXOUT16) U7.A4(C:XDMA_EVENT_INTR0) U7.D13(D:MDC) U7.D14(D:MII1_RXD3) U7.D15(D:MII1_RXD2) U7.D16(D:MII1_RXD1) U7.E1(D:LCD_AC_BIAS_EN) U7.E13(D:MDIO) U7.E14(D:MII1_RXD0) U7.E15(D:MII1_RX_ER) U7.E16(D:MII1_RX_CLK) U7.F2(D:LCD_HSYNC) U7.F14(D:MII1_CRS) U7.F15(D:MII1_COL) U7.F16(D:MII1_RX_DV) U7.G14(D:MII1_TX_EN) U7.G15(D:MII1_TXD3) U7.G16(D:MII1_TXD2) U7.H14(D:MII1_TXD1) U7.H15(D:MII1_TXD0) U7.H16(D:MII1_TX_CLK) U7.J14(D:RMII1_REF_CLK) U7.M1(C:GPMC_ADVN_ALE) U7.N1(C:GPMC_OEN_REN) U7.N2(C:GPMC_WEN) U7.N3(C:GPMC_BEN0_CLE) U7.N14(C:GPMC_BEN1) U7.P3(C:GPMC_CSN0) U7.P5(C:GPMC_AD9) U7.P7(C:GPMC_AD15) U7.P12(C:GPMC_A2) U7.P15(C:GPMC_WAIT0) U7.R5(C:GPMC_AD10) U7.R7(C:GPMC_CSN3) U7.R12(C:GPMC_A1) U7.R15(C:GPMC_A10) U7.R16(C:GPMC_WPN) U7.T4(C:GPMC_AD8) U7.T5(C:GPMC_AD11) U7.T6(C:GPMC_AD14) U7.T7(C:GPMC_CLK) U7.T12(C:GPMC_A0) U7.T13(C:GPMC_A3) U7.T15(C:GPMC_A9) U7.T16(C:GPMC_A11)

### Buses
PRUBUS:PRU0_0,PRU0_1,PRU0_2,PRU0_3,PRU0_4,PRU0_5,PRU0_6,PRU0_7,PRU0_14,PRU0_15,PRU0_16_CLK
SPI1_BUS:SPI1_CLK,SPI1_MISO,SPI1_MOSI

### Notes on the sheet
- CAN Transceiver
- CAN1 RX --> B11 --> UART1_TXD 
  CAN1 TX --> A11 --> UART1_RXD
- SPI Flash/EEPROM
  For SPI boot
  DNP for now
- SYSBOOT Circuit
- USR LEDs
- Boot SD 
  SYSBOOT[4 : 0] == 0b11000
  SPI0 -> MMC0 -> USB0 -> UART0
  
  Boot eMMC
  SYSBOOT[4 : 0] == 0b11100
  MMC1 -> MMC0 -> UART0 -> USB0
- SYSBOOT Jumper to config boot order
  must use very light pullups because 
  boot config is latched at boot and then
  the pins a used for other purposes
- Default Sysboot Pins
  SYSBOOT[4 : 0] == 0b11x00
  SYSBOOT[2] HIGH == eMMC
  SYSBOOT[2] LOW == SD Card
- SD Card Circuit
  pinout from RED board
- eMMC Circuit
- SYSBOOT2 pulled high by default to boot
  eMMC. Manual jumper here to override
- These capacitor values have varied slightly in
  the different designs I have looked at, but these
  values should be fine
- SYSBOOT[15 : 5] == 0b0100_0000_000
- Need ~2.2uF here, but using two 1uF for simplicity
- Sensor only uses 7 bits. 
  Optional pulldown so this
  bit is always read as 0
- PIRT1280 Enable and TEC enable GPIO. 
  We are using these pins because they 
  are free and are the ones we used on 
  pocketbeagle board
- DESERIALIZER
- Only need to connect 7 bits + clock
- OreSat Star Tracker: Camera, eMMC
- 1.2

## Sheet 4 of 5: OSD3358 USB, XTAL, ADC, etc : SIP B
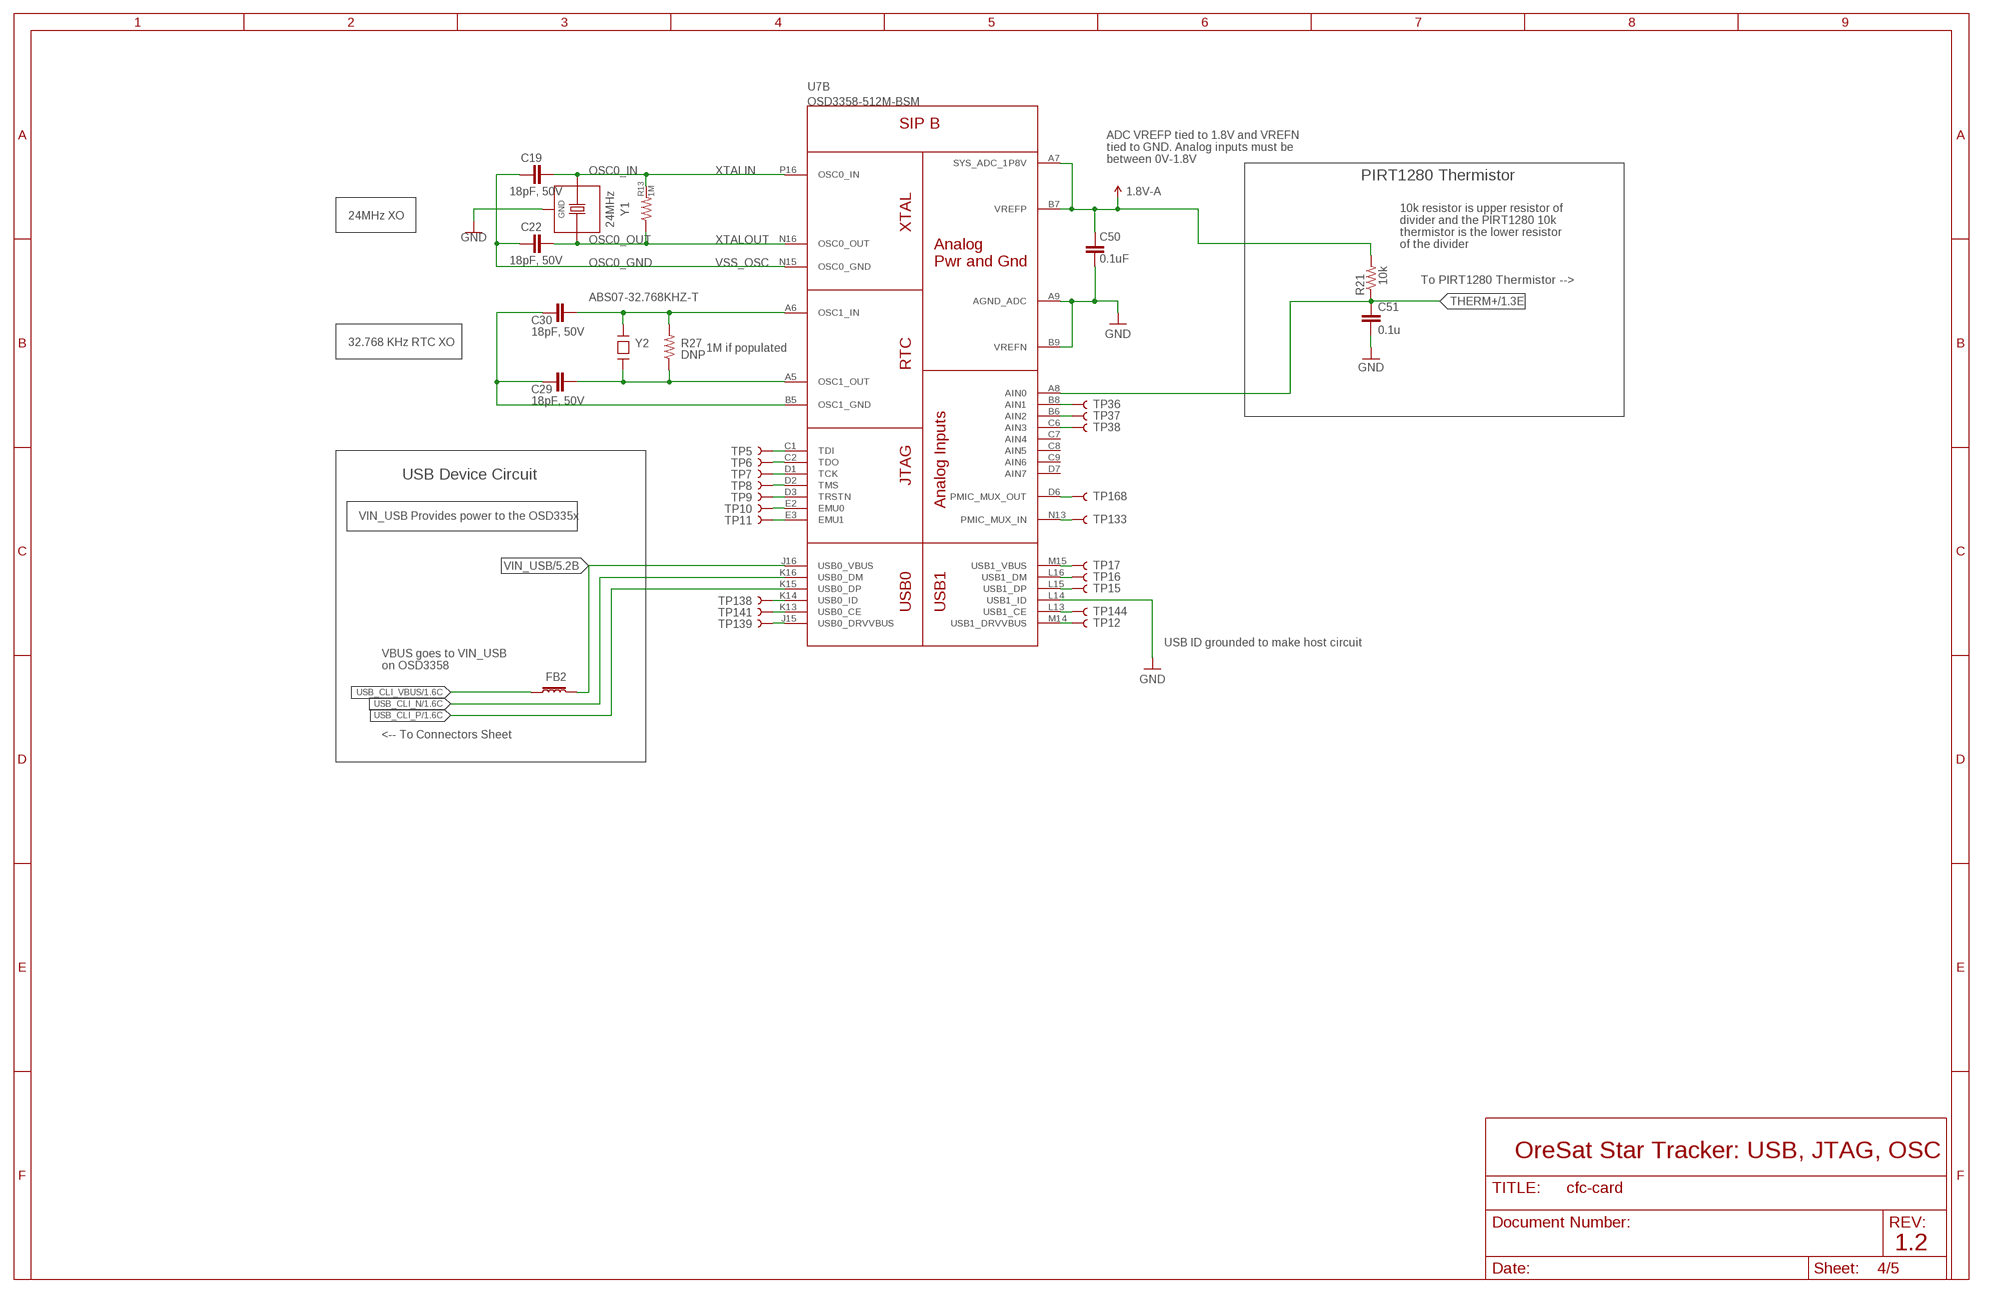
[diagram p7: schematic, sheet 4]

### Parts
C19  18pF, 50V  C-EU0603-A  [.0603-A]
C22  18pF, 50V  C-EU0603-A  [.0603-A]
C29  18pF, 50V  C-EU0603-A  [.0603-A]
C30  18pF, 50V  C-EU0603-A  [.0603-A]
C50  0.1uF  C-EU0603-A  [.0603-A]
C51  0.1u  C-EU0603-A  [.0603-A]
FB2  30Ω/1.8A  FERRITE_BEAD-0603  [0603]
R13  1M  R-US_0603-A  [.0603-A]
R21  10k  R-US_0603-A  [.0603-A]
R27  DNP  R-US_0603-A  [.0603-A]
TP5  TEST-POINT3X4  [PAD.03X.04]
TP6  TEST-POINT3X4  [PAD.03X.04]
TP7  TEST-POINT3X4  [PAD.03X.04]
TP8  TEST-POINT3X4  [PAD.03X.04]
TP9  TEST-POINT3X4  [PAD.03X.04]
TP10  TEST-POINT3X4  [PAD.03X.04]
TP11  TEST-POINT3X4  [PAD.03X.04]
TP12  TEST-POINT3X4  [PAD.03X.04]
TP15  TEST-POINT3X4  [PAD.03X.04]
TP16  TEST-POINT3X4  [PAD.03X.04]
TP17  TEST-POINT3X4  [PAD.03X.04]
TP36  TEST-POINT3X4  [PAD.03X.04]
TP37  TEST-POINT3X4  [PAD.03X.04]
TP38  TEST-POINT3X4  [PAD.03X.04]
TP133  TEST-POINT3X4  [PAD.03X.04]
TP138  TEST-POINT3X4  [PAD.03X.04]
TP139  TEST-POINT3X4  [PAD.03X.04]
TP141  TEST-POINT3X4  [PAD.03X.04]
TP144  TEST-POINT3X4  [PAD.03X.04]
TP168  TEST-POINT3X4  [PAD.03X.04]
Y1  24MHz  ECS-240-12-30BQ-AEN-TR  [5X3.2-4SMD]
Y2  ABS07-32.768KHZ-T  [CRYSTAL_3.2X1.5]

### Nets
1.8V-A: C50.1 R21.2 U7.A7(B:SYS_ADC_1P8V) U7.B7(B:VREFP)
GND: C50.2 C51.2 U7.A9(B:AGND_ADC) U7.B9(B:VREFN) U7.L14(B:USB1_ID) Y1.2(GND) Y1.4(GND) ; also sheet 1,2,3,5
N$8: TP11.P$1 U7.E3(B:EMU1)
N$16: TP10.P$1 U7.E2(B:EMU0)
N$17: TP9.P$1 U7.D3(B:TRSTN)
N$18: TP8.P$1 U7.D2(B:TMS)
N$24: TP7.P$1 U7.D1(B:TCK)
N$37: TP36.P$1 U7.B8(B:AIN1)
N$38: TP37.P$1 U7.B6(B:AIN2)
N$39: TP38.P$1 U7.C6(B:AIN3)
N$73: TP141.P$1 U7.K13(B:USB0_CE)
N$74: TP139.P$1 U7.J15(B:USB0_DRVVBUS)
N$90: TP168.P$1 U7.D6(B:PMIC_MUX_OUT)
N$91: TP6.P$1 U7.C2(B:TDO)
N$92: TP144.P$1 U7.L13(B:USB1_CE)
N$101: TP5.P$1 U7.C1(B:TDI)
N$102: TP15.P$1 U7.L15(B:USB1_DP)
N$104: TP138.P$1 U7.K14(B:USB0_ID)
N$109: TP12.P$1 U7.M14(B:USB1_DRVVBUS)
N$119: TP16.P$1 U7.L16(B:USB1_DM)
N$120: TP17.P$1 U7.M15(B:USB1_VBUS)
OSC0_GND: C19.1 C22.1 U7.N15(B:OSC0_GND)
OSC0_IN: C19.2 R13.2 U7.P16(B:OSC0_IN) Y1.1(X1)
OSC0_OUT: C22.2 R13.1 U7.N16(B:OSC0_OUT) Y1.3(X2)
OSC1_GND1: C29.2 C30.2 U7.B5(B:OSC1_GND)
OSC1_IN1: C30.1 R27.2 U7.A6(B:OSC1_IN) Y2.P$2
OSC1_OUT1: C29.1 R27.1 U7.A5(B:OSC1_OUT) Y2.P$1
PMIC_MUX_IN: TP133.P$1 U7.N13(B:PMIC_MUX_IN)
THERM+: C51.1 R21.1 U7.A8(B:AIN0) ; also sheet 1
USB_CLI_N: U7.K16(B:USB0_DM) ; also sheet 1
USB_CLI_P: U7.K15(B:USB0_DP) ; also sheet 1
USB_CLI_VBUS: FB2.1 ; also sheet 1
VIN_USB: FB2.2 U7.J16(B:USB0_VBUS) ; also sheet 5
Unconnected: U7.C7(B:AIN4) U7.C8(B:AIN5) U7.C9(B:AIN6) U7.D7(B:AIN7)

### Notes on the sheet
- ADC VREFP tied to 1.8V and VREFN
  tied to GND. Analog inputs must be
  between 0V-1.8V
- XTALIN
- PIRT1280 Thermistor
- 24MHz XO
- XTALOUT
- 10k resistor is upper resistor of 
  divider and the PIRT1280 10k 
  thermistor is the lower resistor 
  of the divider
- VSS_OSC
- To PIRT1280 Thermistor -->
- 32.768 KHz RTC XO
- 1M if populated
- USB Device Circuit
- VIN_USB Provides power to the OSD335x
- USB ID grounded to make host circuit
- VBUS goes to VIN_USB
  on OSD3358
- <-- To Connectors Sheet
- OreSat Star Tracker: USB, JTAG, OSC
- 1.2

## Sheet 5 of 5: OSD3358 PWR, ETC. : SIP A, E, F
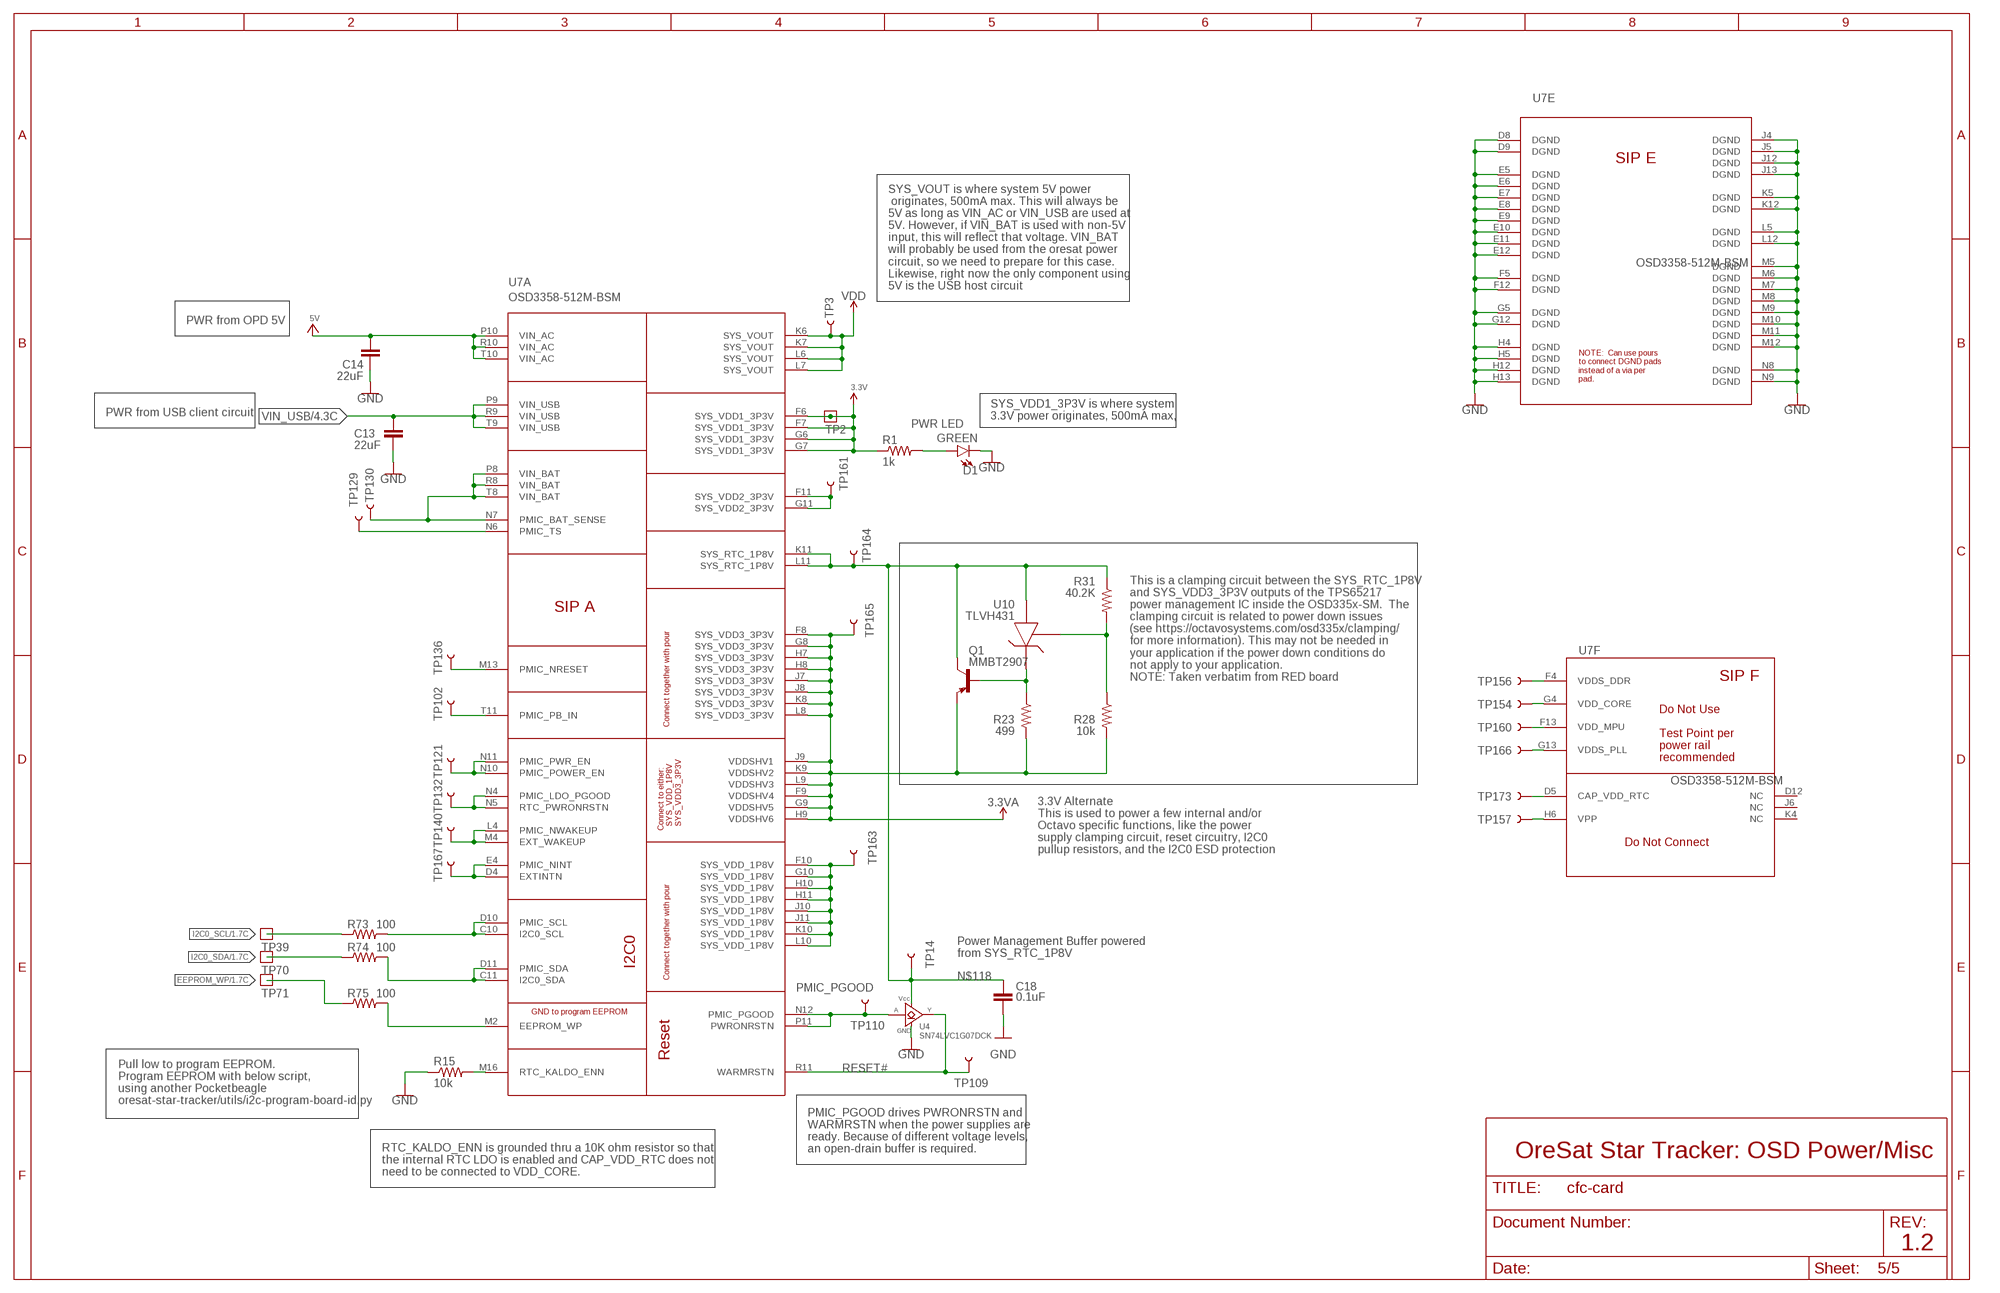
[diagram p8: schematic, sheet 5]

### Parts
C13  22uF  C-EUC1210  [C1210]
C14  22uF  C-EUC1210  [C1210]
C18  0.1uF  C-EU0603-A  [.0603-A]
D1  GREEN  LED-GREEN0603  [LED-0603]
Q1  MMBT2907  MMBT2907SMD  [SOT23-BEC]
R1  1k  R-US_0603-A  [.0603-A]
R15  10k  R-US_0603-A  [.0603-A]
R23  499  R-US_0603-A  [.0603-A]
R28  10k  R-US_0603-A  [.0603-A]
R31  40.2K  R-US_0603-A  [.0603-A]
R73  100  R-US_0603-A  [.0603-A]
R74  100  R-US_0603-A  [.0603-A]
R75  100  R-US_0603-A  [.0603-A]
TP2  TEST-POINT  [2MM-TEST-POINT]
TP3  TEST-POINT3X4  [PAD.03X.04]
TP14  TEST-POINT3X4  [PAD.03X.04]
TP39  TEST-POINT  [2MM-TEST-POINT]
TP70  TEST-POINT  [2MM-TEST-POINT]
TP71  TEST-POINT  [2MM-TEST-POINT]
TP102  TEST-POINT3X4  [PAD.03X.04]
TP109  TEST-POINT3X4  [PAD.03X.04]
TP110  TEST-POINT3X4  [PAD.03X.04]
TP121  TEST-POINT3X4  [PAD.03X.04]
TP129  TEST-POINT3X4  [PAD.03X.04]
TP130  TEST-POINT3X4  [PAD.03X.04]
TP132  TEST-POINT3X4  [PAD.03X.04]
TP136  TEST-POINT3X4  [PAD.03X.04]
TP140  TEST-POINT3X4  [PAD.03X.04]
TP154  TEST-POINT3X4  [PAD.03X.04]
TP156  TEST-POINT3X4  [PAD.03X.04]
TP157  TEST-POINT3X4  [PAD.03X.04]
TP160  TEST-POINT3X4  [PAD.03X.04]
TP161  TEST-POINT3X4  [PAD.03X.04]
TP163  TEST-POINT3X4  [PAD.03X.04]
TP164  TEST-POINT3X4  [PAD.03X.04]
TP165  TEST-POINT3X4  [PAD.03X.04]
TP166  TEST-POINT3X4  [PAD.03X.04]
TP167  TEST-POINT3X4  [PAD.03X.04]
TP173  TEST-POINT3X4  [PAD.03X.04]
U4  SN74LVC1G07DCK  [C70(TI-DCK)]
U10  TLVH431  [SOT23-3]

### Nets
3.3V: R1.1 TP2.1 U7.F6(A:SYS_VDD1_3P3V) U7.F7(A:SYS_VDD1_3P3V) U7.G6(A:SYS_VDD1_3P3V) U7.G7(A:SYS_VDD1_3P3V) ; also sheet 3
3.3VA: Q1.E R23.2 R28.2 TP165.P$1 U7.F8(A:SYS_VDD3_3P3V) U7.F9(A:VDDSHV4) U7.G8(A:SYS_VDD3_3P3V) U7.G9(A:VDDSHV5) U7.H7(A:SYS_VDD3_3P3V) U7.H8(A:SYS_VDD3_3P3V) U7.H9(A:VDDSHV6) U7.J7(A:SYS_VDD3_3P3V) U7.J8(A:SYS_VDD3_3P3V) U7.J9(A:VDDSHV1) U7.K8(A:SYS_VDD3_3P3V) U7.K9(A:VDDSHV2) U7.L8(A:SYS_VDD3_3P3V) U7.L9(A:VDDSHV3)
5V: C14.1 U7.P10(A:VIN_AC) U7.R10(A:VIN_AC) U7.T10(A:VIN_AC) ; also sheet 2
EEPROM_WP: R75.1 TP71.1 ; also sheet 1
GND: C13.2 C14.2 C18.2 D1.C R15.1 U4.3(GND) U7.D8(E:DGND) U7.D9(E:DGND) U7.E5(E:DGND) U7.E6(E:DGND) U7.E7(E:DGND) U7.E8(E:DGND) U7.E9(E:DGND) U7.E10(E:DGND) U7.E11(E:DGND) U7.E12(E:DGND) U7.F5(E:DGND) U7.F12(E:DGND) U7.G5(E:DGND) U7.G12(E:DGND) U7.H4(E:DGND) U7.H5(E:DGND) U7.H12(E:DGND) U7.H13(E:DGND) U7.J4(E:DGND) U7.J5(E:DGND) U7.J12(E:DGND) U7.J13(E:DGND) U7.K5(E:DGND) U7.K12(E:DGND) U7.L5(E:DGND) U7.L12(E:DGND) U7.M5(E:DGND) U7.M6(E:DGND) U7.M7(E:DGND) U7.M8(E:DGND) U7.M9(E:DGND) U7.M10(E:DGND) U7.M11(E:DGND) U7.M12(E:DGND) U7.N8(E:DGND) U7.N9(E:DGND) ; also sheet 1,2,3,4
I2C0_SCL: R73.1 TP39.1 ; also sheet 1
I2C0_SDA: R74.1 TP70.1 ; also sheet 1
N$22: R28.1 R31.2 U10.1(REF)
N$23: Q1.B R23.1 U10.2(CATHODE)
N$60: TP157.P$1 U7.H6(F:VPP)
N$61: TP173.P$1 U7.D5(F:CAP_VDD_RTC)
N$62: TP166.P$1 U7.G13(F:VDDS_PLL)
N$63: TP160.P$1 U7.F13(F:VDD_MPU)
N$64: TP154.P$1 U7.G4(F:VDD_CORE)
N$65: TP156.P$1 U7.F4(F:VDDS_DDR)
N$88: D1.A R1.2
N$114: R74.2 U7.C11(A:I2C0_SDA) U7.D11(A:PMIC_SDA)
N$115: R75.2 U7.M2(A:EEPROM_WP)
N$116: R73.2 U7.C10(A:I2C0_SCL) U7.D10(A:PMIC_SCL)
N$118: C18.1 Q1.C R31.1 TP14.P$1 TP164.P$1 U4.5(VCC) U7.K11(A:SYS_RTC_1P8V) U7.L11(A:SYS_RTC_1P8V) U10.3(ANODE)
N$401: TP130.P$1 U7.N7(A:PMIC_BAT_SENSE) U7.P8(A:VIN_BAT) U7.R8(A:VIN_BAT) U7.T8(A:VIN_BAT)
N$404: TP129.P$1 U7.N6(A:PMIC_TS)
N$405: TP161.P$1 U7.F11(A:SYS_VDD2_3P3V) U7.G11(A:SYS_VDD2_3P3V)
N$499: TP163.P$1 U7.F10(A:SYS_VDD_1P8V) U7.G10(A:SYS_VDD_1P8V) U7.H10(A:SYS_VDD_1P8V) U7.H11(A:SYS_VDD_1P8V) U7.J10(A:SYS_VDD_1P8V) U7.J11(A:SYS_VDD_1P8V) U7.K10(A:SYS_VDD_1P8V) U7.L10(A:SYS_VDD_1P8V)
N$504: TP167.P$1 U7.D4(A:EXTINTN) U7.E4(A:PMIC_NINT)
N$519: TP140.P$1 U7.L4(A:PMIC_NWAKEUP) U7.M4(A:EXT_WAKEUP)
N$520: TP132.P$1 U7.N4(A:PMIC_LDO_PGOOD) U7.N5(A:RTC_PWRONRSTN)
N$524: TP121.P$1 U7.N10(A:PMIC_POWER_EN) U7.N11(A:PMIC_PWR_EN)
N$525: TP102.P$1 U7.T11(A:PMIC_PB_IN)
N$529: TP136.P$1 U7.M13(A:PMIC_NRESET)
N$609: R15.2 U7.M16(A:RTC_KALDO_ENN)
PMIC_PGOOD: TP110.P$1 U4.2(A) U7.N12(A:PMIC_PGOOD) U7.P11(A:PWRONRSTN)
RESET#: TP109.P$1 U4.4(Y) U7.R11(A:WARMRSTN)
VDD: TP3.P$1 U7.K6(A:SYS_VOUT) U7.K7(A:SYS_VOUT) U7.L6(A:SYS_VOUT) U7.L7(A:SYS_VOUT) ; also sheet 1
VIN_USB: C13.1 U7.P9(A:VIN_USB) U7.R9(A:VIN_USB) U7.T9(A:VIN_USB) ; also sheet 4
Unconnected: U7.D12(F:NC) U7.J6(F:NC) U7.K4(F:NC)

### Notes on the sheet
- SYS_VOUT is where system 5V power
   originates, 500mA max. This will always be 
  5V as long as VIN_AC or VIN_USB are used at
  5V. However, if VIN_BAT is used with non-5V
  input, this will reflect that voltage. VIN_BAT
  will probably be used from the oresat power
  circuit, so we need to prepare for this case.
  Likewise, right now the only component using 
  5V is the USB host circuit
- PWR from OPD 5V
- PWR from USB client circuit
- SYS_VDD1_3P3V is where system 
  3.3V power originates, 500mA max,
- PWR LED
- This is a clamping circuit between the SYS_RTC_1P8V 
  and SYS_VDD3_3P3V outputs of the TPS65217
  power management IC inside the OSD335x-SM.  The
  clamping circuit is related to power down issues 
  (see https://octavosystems.com/osd335x/clamping/ 
  for more information). This may not be needed in 
  your application if the power down conditions do 
  not apply to your application.
  NOTE: Taken verbatim from RED board
- 3.3V Alternate
  This is used to power a few internal and/or 
  Octavo specific functions, like the power
  supply clamping circuit, reset circuitry, I2C0
  pullup resistors, and the I2C0 ESD protection
- Power Management Buffer powered
  from SYS_RTC_1P8V
- Pull low to program EEPROM.
  Program EEPROM with below script,
  using another Pocketbeagle
  oresat-star-tracker/utils/i2c-program-board-id.py
- PMIC_PGOOD drives PWRONRSTN and
  WARMRSTN when the power supplies are
  ready. Because of different voltage levels,
  an open-drain buffer is required.
- OreSat Star Tracker: OSD Power/Misc
- RTC_KALDO_ENN is grounded thru a 10K ohm resistor so that 
  the internal RTC LDO is enabled and CAP_VDD_RTC does not 
  need to be connected to VDD_CORE.
- 1.2

## Library data of the parts
C1 C7 C16 C17 C20 C28 = oresat-rcl:C-EU: CAPACITOR, European symbol; DIS: Digi-Key; DPN: 490-6350-1-ND; MFR: Murata; MPN: GRM155R71H102KA01J
C2-C6 C8-C14 C18 C19 C22 C29-C32 C34-C40 C44 C50 C51 = oresat-rcl:C-EU: CAPACITOR, European symbol
C21 C23-C27 = oresat-rcl:C-EU: CAPACITOR, European symbol; DIS: Digi-Key; DPN: 399-7842-1-ND; MFR: Kemet; MPN: C0603C103M5RACTU
C33 = oresat-rcl:C-EU: CAPACITOR, European symbol; DIS: Digi-Key; DPN: 1276-1001-1-ND; MFR: Samsung
C42 C43 C45-C48 = oresat-rcl:C-EU: CAPACITOR, European symbol; DIS: Digi-Key; DPN: 399-1177-1-ND; MFR: Kemet; MPN: C0805C104Z5VACTU
C49 = oresat-rcl:C-EU: CAPACITOR, European symbol; DIS: Digi-Key; DPN: 490-14372-1-ND; MFR: Murata; MPN: GRM188R61A106KE69J
D1 D7 D8 = SparkFun-LED:LED-GREEN: Green SMD LED Used in manufacturing of various products at SparkFun Packages: 0603 - SMD 0603 package [Product Link] <http://www.futureelectronics.com/en/technologies/semiconductors/optoelectronics/leds/Pages/9894312-LTST-C190GKT.aspx?CrossPart=HSMG-C190&IM=0> LilyPad 1206 - SMD1206 LilyPad package [Product Link] <http://www.futureelectronics.com/en/Technologies/Product.aspx?ProductID=IN150NGHARVATEKCORPORATION2049943&IM=0> 1206 - SMD1206 package [Product Link] <http://www.futureelectronics.com/en/technologies/semiconductors/optoelectronics/leds/Pages/8315665-LTST-C150KGKT.aspx?IM=0> 1206 Bottom Mount -SMD 1206 Bottom Mount [Product Link] <http://www.digikey.com/product-detail/en/lite-on-inc/LTST-C230KGKT/160-1456-1-ND/386854> SparkFun Products: Pro Mini 328 -5V <https://www.sparkfun.com/products/821> RedBoard <https://www.sparkfun.com/products/12757> MP3 Trigger <https://www.sparkfun.com/products/13720> Makey Makey <https://www.sparkfun.com/products/11076>
D2-D5 = SparkFun-LED:LED-BLUE: Blue SMD LED Used in manufacturing of various products at SparkFun Packages: 0603 - SMD 0603 package [Product Link] <http://www.digikey.com/product-detail/en/SMLE12BC7TT86/511-1589-2-ND/1641808> 1206 - SMD1206 package [Product Link] <http://www.digikey.com/product-detail/en/lite-on-inc/LTST-C150TBKT/160-1643-1-ND/573584> SparkFun Products: ESP8266 Thing-Dev Board <https://www.sparkfun.com/products/13711> RedBoard <https://www.sparkfun.com/products/12757>; PROD_ID: DIO-08575
D6 = SparkFun-LED:LED-GREEN: Green SMD LED Used in manufacturing of various products at SparkFun Packages: 0603 - SMD 0603 package [Product Link] <http://www.futureelectronics.com/en/technologies/semiconductors/optoelectronics/leds/Pages/9894312-LTST-C190GKT.aspx?CrossPart=HSMG-C190&IM=0> LilyPad 1206 - SMD1206 LilyPad package [Product Link] <http://www.futureelectronics.com/en/Technologies/Product.aspx?ProductID=IN150NGHARVATEKCORPORATION2049943&IM=0> 1206 - SMD1206 package [Product Link] <http://www.futureelectronics.com/en/technologies/semiconductors/optoelectronics/leds/Pages/8315665-LTST-C150KGKT.aspx?IM=0> 1206 Bottom Mount -SMD 1206 Bottom Mount [Product Link] <http://www.digikey.com/product-detail/en/lite-on-inc/LTST-C230KGKT/160-1456-1-ND/386854> SparkFun Products: Pro Mini 328 -5V <https://www.sparkfun.com/products/821> RedBoard <https://www.sparkfun.com/products/12757> MP3 Trigger <https://www.sparkfun.com/products/13720> Makey Makey <https://www.sparkfun.com/products/11076>; VALUE: GREEN
FB2 = SparkFun-Coils:FERRITE_BEAD: Ferrite Bead (blocks, cores, rings, chokes, etc.) Inductor with layers of ferrite used to suppress high frequencies. Often used to isolate high frequency noise. SparkFun Products: IOIO-OTG - V2.2 <https://www.sparkfun.com/products/13613> SparkFun SAMD21 Mini Breakout <https://www.sparkfun.com/products/13664> SparkFun 6 Degrees of Freedom Breakout - LSM6DS3 <https://www.sparkfun.com/products/13339> SparkFun SAMD21 Dev Breakout <https://www.sparkfun.com/products/13672>; DPN: 490-14027-1-ND; MPN: BLM18KG300JH1D
J1 = oresat-debug-connector:ORESAT-DEBUG-CONNECTOR; DPN: A100287CT-ND; MPN: 2-1734592-0
J2 = J-Samtec-TFM-110-X1-XXX-D-RA:J-SAMTEC-TFM-110-X1-XXX-D-RA; DIS: Digikey; DPN: SAM10113-ND; MFR: Samtec; MPN: TFM-110-01-L-D-RA
J3 = SparkFun-Connectors:CONN_03: Multi connection point. Often used as Generic Header-pin footprint for 0.1 inch spaced/style header connections On any of the 0.1 inch spaced packages, you can populate with these: Break Away Headers - Straight <https://www.sparkfun.com/products/116> (PRT-00116) Break Away Male Headers - Right Angle <https://www.sparkfun.com/products/553> (PRT-00553) Female Headers <https://www.sparkfun.com/products/115> (PRT-00115) Break Away Headers - Machine Pin <https://www.sparkfun.com/products/117> (PRT-00117) Break Away Female Headers - Swiss Machine Pin <https://www.sparkfun.com/products/743> (PRT-00743) Stackable Header - 3 Pin (Female, 0.1") <https://www.sparkfun.com/products/13875> (PRT-13875) For SCREWTERMINALS and SPRING TERMINALS visit here: Screw Terimnals on SparkFun.com <https://www.sparkfun.com/search/results?term=Screw+Terminals> (5mm/3.5mm/2.54mm spacing) This device is also useful as a general connection point to wire up your design to another part of your project. Our various solder wires solder well into these plated through hole pads. Hook-Up Wire - Assortment (Stranded, 22 AWG) <https://www.sparkfun.com/products/11375> (PRT-11375) Hook-Up Wire - Assortment (Solid Core, 22 AWG) <https://www.sparkfun.com/products/11367> (PRT-11367) View the entire wire category on our website here <https://www.sparkfun.com/categories/141> Special notes: Molex polarized connector foot print use with SKU : PRT-08232 with associated crimp pins and housings.
J4 = J-Samtec-TFM-120-X1-XXX-D-RA:J-SAMTEC-TFM-120-X1-XXX-D-RA; DPN: SAM10145-ND; MPN: TFM-120-01-L-D-RA
J100 = J-Hirose-DM3BT-DSF-PEJS:DM3BT-DSF-PEJS: HIROSE - microSD Card socket - Reverse on-Board - Push / Push; DPN: DM3BT-DSF-PEJS; MPN: DM3BT-DSF-PEJS
JP1 = SparkFun-Jumpers:JUMPER-SMT_2_NC_TRACE: Normally closed trace jumper This jumper has a trace between two pads so it's normally closed (NC). Use a razor knife to open the connection. For best results follow the IPC guidelines for cutting traces: Cutout at least 0.063 mm (0.005 in). Remove all loose material to clean up the cut area. Seal the cut with an approved epoxy. Reapply solder to reclose the connection.
JP2 = SparkFun-Jumpers:JUMPER-SMT_3_1-NC_TRACE: Normally closed trace jumper (1 of 2 connections) This jumper has a trace between two pads so it's normally closed (NC). The other connection is normally open (NO). Use a razor knife to open the connection. For best results follow the IPC guidelines for cutting traces: Cutout at least 0.063 mm (0.005 in). Remove all loose material to clean up the cut area. Seal the cut with an approved epoxy. Reapply solder to reclose the connection, or to close the NO connection.
JP3 = SparkFun-Jumpers:JUMPER-SMT_2_NO: Normally open jumper This jumper has two pads in close proximity to each other. Apply solder to close the connection. Round pads are easier to solder for beginners, but are a lot larger. SparkFun Product that uses the round pads: SparkFun EL Sequencer <https://www.sparkfun.com/products/12781>
L1 = L-ECS-MPI4040:L-ECS-MPI4040; DPN: XC2337CT-ND; MPN: ECS-MPI4040R4-6R8-R
PCB1 = oresat-cards:ORESAT-CARD-V1.3-GENERIC-0RF
Q1 = Q-Diodesinc-MMBT2907-PNP:MMBT2907*: PNP Transistror; DPN: MMBT2907A-FDICT-ND; MPN: MMBT2907A-7-F
Q2 Q4 = Tova:PMV45EN; DPN: 1727-2307-1-ND; MPN: PMV45EN2R
Q3 = Q-MOSFET-PCH-dual-SOT23-6:MOSFET-PCH-SOT23-6: Dual P channel MOSFETs in an SOT23-6; MFR: Diodes Inc; MPN: DMP2240UDM-7
Q5 Q6 = Q-MOSFET-PCH-SOT23-6:MOSFET-PCH-SOT23-6: P channel MOSFET in an SOT23-6; DPN: DMP3050LVT-7DICT-ND; MPN: DMP3050LVT-7
R1-R5 R11 R13-R15 R21 R23 R27 R28 R31 R32 R34-R37 R39 R41 R43-R50 R52 R59-R62 R64 R71-R75 = oresat-rcl:R-US_: RESISTOR, American symbol
R6 R7 R29 R30 = oresat-rcl:R-US_: RESISTOR, American symbol; DIS: Dgi-Key; DPN: 311-100MCT-ND; MFR: Yageo; MPN: RC0201FR-07100RL
R8-R10 = R-Panasonic-EXB_A10PXXXJ:EXB-A10P391J; DPN: U7103CT-ND; MFR: Panasonic Electronic Components; MPN_GENERIC: EXB-A10PXXXJ
R16 R17 = R-Panasonic-EXB-2HV103JV:EXB-2HV103JV; BUILT_BY: EMA_UL_Team; DPN: Y1103CT-ND; MPN: EXB-2HV103JV; SOURCELIBRARY: Update_to_database_2020-12-03; VENDOR: Panasonic
R33 R38 R40 R42 R51 R53-R58 R65-R70 = oresat-rcl:R-US_: RESISTOR, American symbol; DIS: Digi-Key; DPN: 1276-4275-1-ND; MFR: Samsung; MPN: RC1005F6653CS
R63 = rcl:R-US_: RESISTOR, American symbol; SPICEPREFIX: R
SB0 SB1-SB15 = oresat-misc:TEST-POINT-SMALL; BOM: EXCLUDE
TP1 TP2 TP18-TP21 TP23 TP24 TP26-TP34 TP39 TP41-TP57 TP63-TP68 TP70-TP72 TP74 TP75 TP77 TP78 = Tova:TEST-POINT
TP3-TP17 TP22 TP35-TP38 TP40 TP69 TP102 TP109 TP110 TP121 TP129 TP130 TP132 TP133 TP136 TP138-TP141 TP144 TP154 TP156 TP157 TP160 TP161 TP163-TP168 TP173 TP183 TP184 = SparkFun-Connectors:TEST-POINT: SparkFun Test Points Bare copper test points for troubleshooting or In-Circuit-Testing. These are used by our Production team for verifying production board runs using pogo-pins on test beds. SparkFun Products: SparkFun LSM9DS1 Breakout <https://www.sparkfun.com/products/13284> SparkFun PSOC <https://www.sparkfun.com/products/13714> SparkFun Load Cell Amplifier <https://www.sparkfun.com/products/13879>
U1 = U-Semtec-RCLAMP0504FB:RCLAMP0504FB; DPN: RCLAMP0504FBTCTCT-ND; MPN: RCLAMP0504FBTCT
U2 = U-TI-DS90CR218-LVDSReceiver:DS90CR218AMTD/NOPB; DIS: Digi-Key; DPN: DS90CR218AMTD/NOPB-ND; MFR: Texas Instruments; MPN: DS90CR218AMTD/NOPB
U3 = U-Generic-eMMC-153pin:EMMC+RESET+5.1-COMPATIBLE: eMMC (embedded multi-media card) memory with optional Reset function NOTE: The only way this differs from the other package is that J5 is connected to VSS, per JEDEC eMMC 5.1 spec; DPN: THGBMJG7C2LBAU8-ND; MPN: THGBMJG7C2LBAU8
U4 = U-TI-SN74LVC1G07DCK-Buffer:SN74LVC1G07DCK; DPN: 296-8486-1-ND; MPN: SN74LVC1G07DCKR
U7 = U-OSD3358-512M-BSM:OSD3358-512M-BSM: Octavo Systems LLC OSD335x Family SiP: 21mm x 21mm, 1.27mm pitch 256 pin BGA contains AM3358, 512MB DDR3, TPS65217, TL5209, 4KB EEPROM and passives. Commerical Temperature (case): 0C to 85C.; DPN: 1676-1002-ND; MFR: Octavo Systems; MPN: OSD3358-512M-BSM; PACKAGE: BGA-400 Octavo Systems
U10 = U-TI-TLVH431-Shunt-Regulator:TLVH431; DPN: 296-36778-1-ND; MPN: TLVH431BQDBZRQ1
U11 = U-TI-TCAN330-CAN-transceiver:TCAN330; DPN: 296-44211-1-ND; MPN: TCAN330GDCNT
U12 U13 = U-Microchip-MIC842-Comparator:MIC842L; DPN: 576-2927-1-ND; MPN: MIC842LYC5
U14 = U-Maxim-MAX4211-power-monitor:MAX4211; DPN: MAX4211FETE+-ND; MPN: MAX4211FETE+
U15 = U-TI-TPS6211x-SPS-buck:TPS6211X: TPS6211x 17-V, 1.5-A, Synchronous Step-Down Converter; DPN: 296-39444-1-ND; MPN: TPS62112RSAR
U16 = U-Maxim-MAX7310-I2C-GPIO-expander:MAX7310; DPN: MAX7310ATE+-ND; MFR: Maxim; MPN: MAX7310ATE
U17 = U-Generic-SPI-EEPROM:25AAXX; MPN: 25AA02E48T-I/SN
U$1 = oresat-flight-marker:FLIGHMARKER
Y1 = X-ECS-240-12-30BQ-AEN-TR:ECS-240-12-30BQ-AEN-TR; DPN: XC2580CT-ND; MPN: ECS-240-12-30BQ-AEN-TR
Y2 = OSD3358-SM-RED Platform:ABS07-32.768KHZ-T: 32kHz crystal; DPN: 535-9542-1-ND; MPN: ABS07-32.768KHZ-T

## Net classes
1 diff pair: width 0.381 mm, clearance 0.508 mm to class 0, clearance 0.254 mm